# EAGLE design 12S (EAGLE 9.2.0)

## Sheet 1 of 2
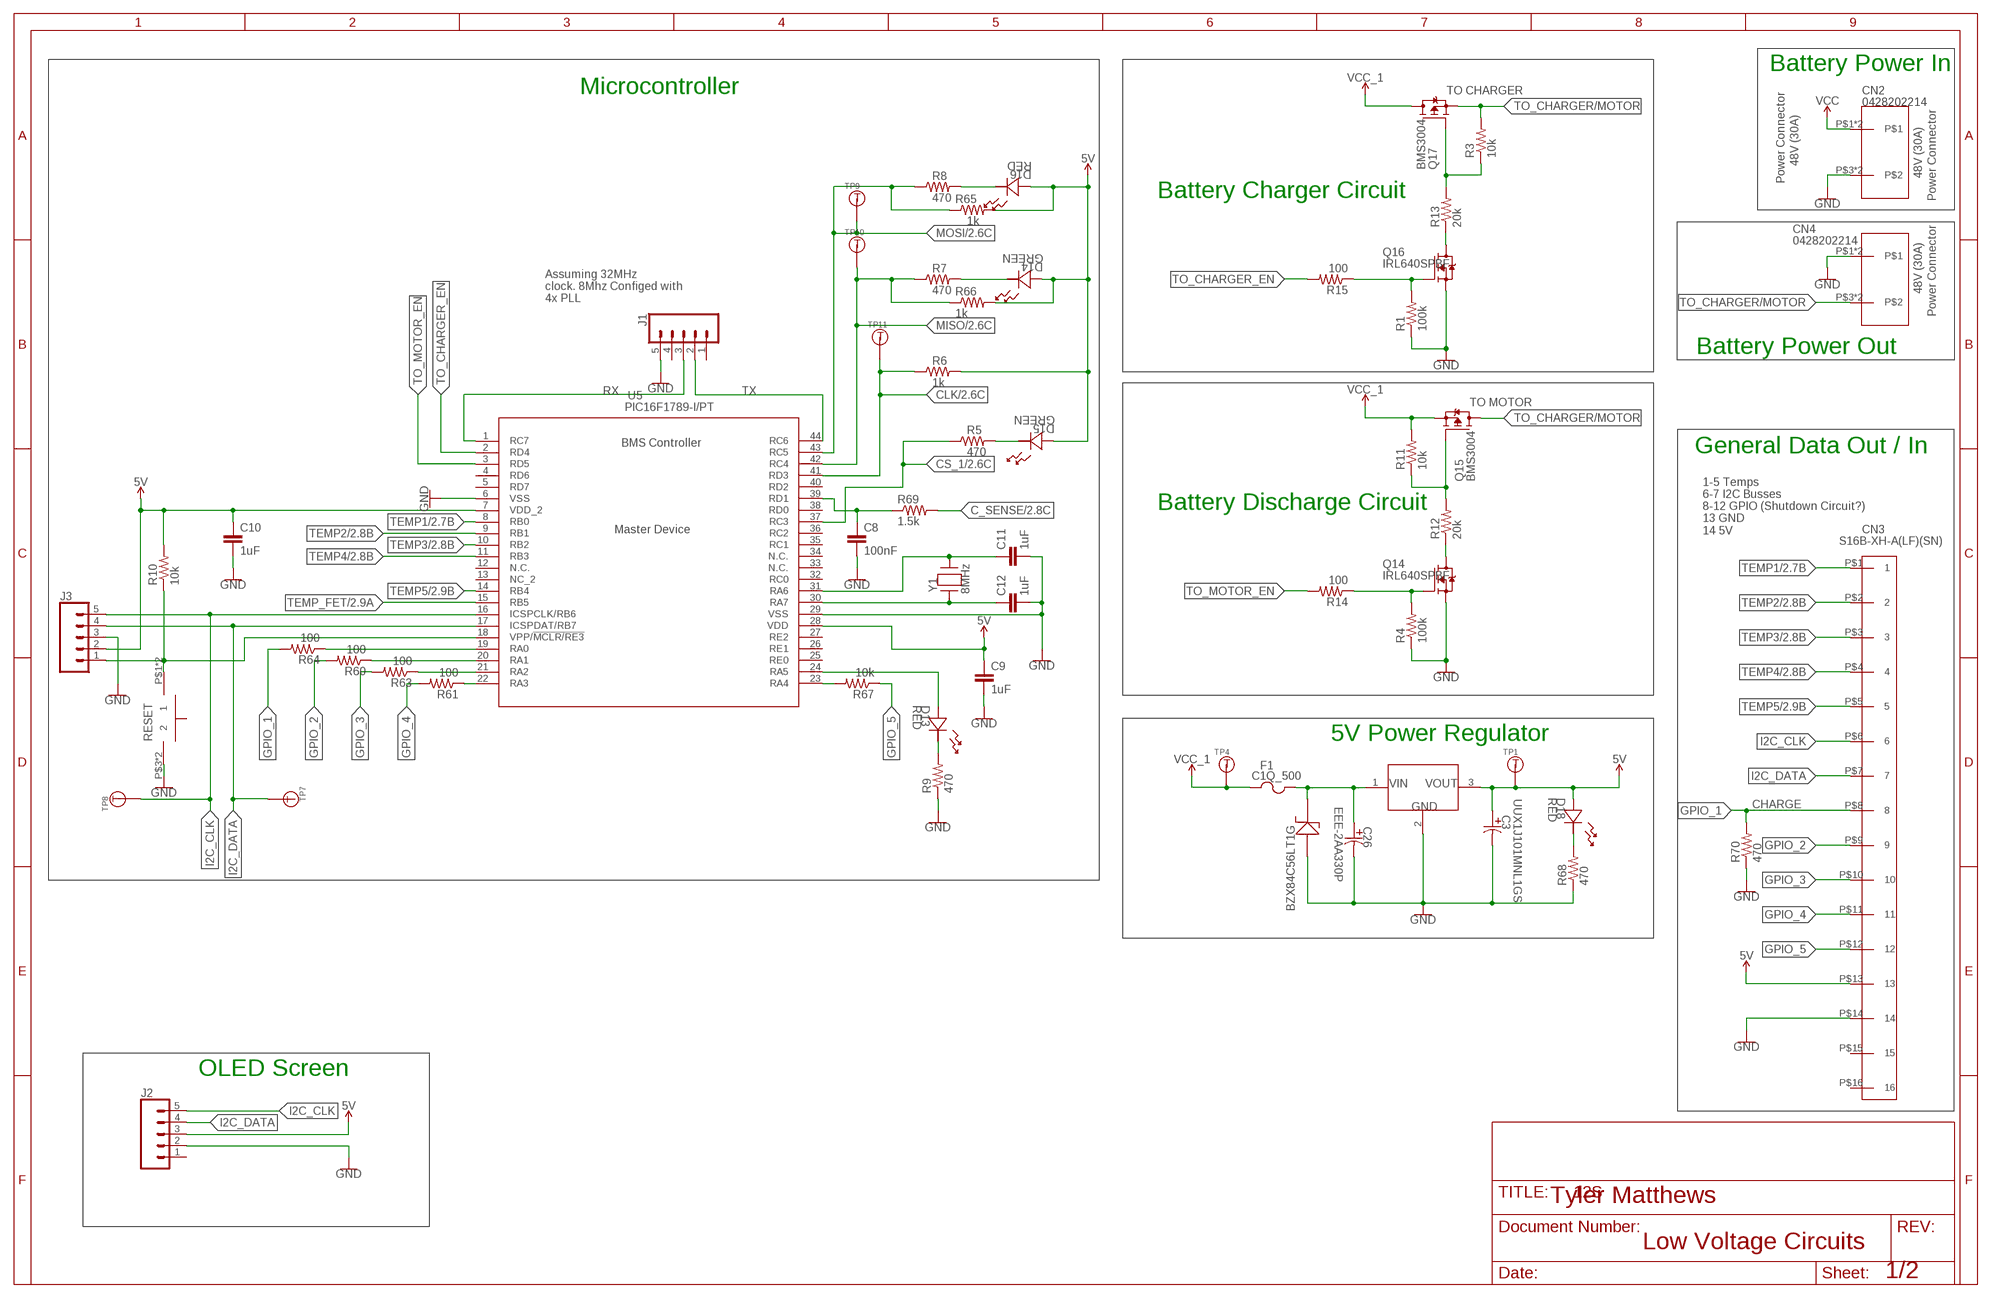
[diagram p0: schematic, sheet 1]

### Parts
C3  UUX1J101MNL1GS  [PCAP_10X10-ELECT]
C8  100nF  C-EUC0603  [C0603]
C9  1uF  C-EUC0603  [C0603]
C10  1uF  C-EUC0603  [C0603]
C11  1uF  C-EUC0603  [C0603]
C12  1uF  C-EUC0603  [C0603]
C26  EEE-2AA330P  [CAP_EEE_G]
CN2  0428202214  [0428202214]
CN3  S16B-XH-A(LF)(SN)  [S16B-XH-A(LF)(SN)]
CN4  0428202214  [0428202214]
D13  RED  LED0603  [LED_DIALIGHT_598]
D14  GREEN  LED0603  [LED_DIALIGHT_598]
D15  GREEN  LED0603  [LED_DIALIGHT_598]
D16  RED  LED0603  [LED_DIALIGHT_598]
D17  BZX84C56LT1G  [SOT-23]
D18  RED  LED0603  [LED_DIALIGHT_598]
F1  C1Q_500  [C1]
J1  CONN_05  [1X05]
J2  CONN_05  [1X05]
J3  CONN_05  [1X05]
Q14  IRL640SPBF  [D2PAK]
Q15  BMS3004  [TO-220]
Q16  IRL640SPBF  [D2PAK]
Q17  BMS3004  [TO-220]
R1  100k  R-US_R0603  [R0603]
R3  10k  R-US_R0603  [R0603]
R4  100k  R-US_R0603  [R0603]
R5  470  R-US_R0603  [R0603]
R6  1k  R-US_R0603  [R0603]
R7  470  R-US_R0603  [R0603]
R8  470  R-US_R0603  [R0603]
R9  470  R-US_R0603  [R0603]
R10  10k  R-US_R0603  [R0603]
R11  10k  R-US_R0603  [R0603]
R12  20k  R-US_R0603  [R0603]
R13  20k  R-US_R0603  [R0603]
R14  100  R-US_R0603  [R0603]
R15  100  R-US_R0603  [R0603]
R60  100  R-US_R0603  [R0603]
R61  100  R-US_R0603  [R0603]
R63  100  R-US_R0603  [R0603]
R64  100  R-US_R0603  [R0603]
R65  1k  R-US_R0603  [R0603]
R66  1k  R-US_R0603  [R0603]
R67  10k  R-US_R0603  [R0603]
R68  470  R-US_R0603  [R0603]
R69  1.5k  R-US_R0603  [R0603]
R70  470  R-US_R0603  [R0603]
S2  TL3305AF260QG  [TL3305AF260QG]
TP1  TP5015  [TP5015]
TP4  TP5015  [TP5015]
TP7  TP5015  [TP5015]
TP8  TP5015  [TP5015]
TP9  TP5015  [TP5015]
TP10  TP5015  [TP5015]
TP11  TP5015  [TP5015]
U3  SRH05S05  [SIP3]
U5  PIC16F1789-I/PT  [TQFP44_MC]
Y1  8MHz  FOXSDLF/080-20  [CRYSTAL_HC49SDLF]

### Nets
5V: C3.1 C9.1 C10.1 CN3.P$13 D14.2 D15.2 D16.2 D18.2 J2.3 J3.2 R6.2 R10.2 R65.2 R66.2 TP1.P$1 U3.3(VOUT) U5.7(VDD_2) U5.28(VDD) ; also sheet 2
C_SENSE: R69.2 ; also sheet 2
CLK: R6.1 TP11.P$1 U5.41(RD3) ; also sheet 2
CS_1: R5.1 U5.37(RC3) ; also sheet 2
GND: C3.2 C8.2 C9.2 C10.2 C11.2 C12.2 C26.2 CN2.P$3 CN2.P$4 CN3.P$14 CN4.P$1 CN4.P$2 D17.1 J1.5 J2.2 J3.3 Q14.2(S) Q16.2(S) R1.1 R4.1 R9.1 R68.1 R70.1 S2.P$3 S2.P$4 U3.2(GND) U5.6(VSS) U5.29(VSS) ; also sheet 2
GPIO_1: CN3.P$8 R64.2 R70.2
GPIO_2: CN3.P$9 R60.2
GPIO_3: CN3.P$10 R63.2
GPIO_4: CN3.P$11 R61.2
GPIO_5: CN3.P$12 R67.1
I2C_CLK: CN3.P$6 J2.5 J3.5 TP8.P$1 U5.16(ICSPCLK/RB6)
I2C_DATA: CN3.P$7 J2.4 J3.4 TP7.P$1 U5.17(ICSPDAT/RB7)
MISO: R7.1 R66.1 TP10.P$1 U5.42(RC4) ; also sheet 2
MOSI: R8.1 R65.1 TP9.P$1 U5.43(RC5) ; also sheet 2
N$1: D16.1 R8.2
N$2: D14.1 R7.2
N$3: D15.1 R5.2
N$4: Q17.1(G) R3.1 R13.2
N$5: R61.1 U5.22(RA3)
N$6: R63.1 U5.21(RA2)
N$7: R60.1 U5.20(RA1)
N$8: R64.1 U5.19(RA0)
N$9: D18.1 R68.2
N$10: R67.2 U5.23(RA4)
N$11: C8.1 R69.1 U5.39(RD1)
N$37: C26.1 D17.3 F1.2 U3.1(VIN)
N$39: Q14.3(D) R12.1
N$41: C11.1 U5.31(RA6) Y1.2
N$43: C12.1 U5.30(RA7) Y1.1
N$44: Q15.1(G) R11.1 R12.2
N$46: Q14.1(G) R4.2 R14.1
N$47: Q16.3(D) R13.1
N$48: Q16.1(G) R1.2 R15.1
N$49: J3.1 R10.1 S2.P$1 S2.P$2 U5.18(VPP/!MCLR/RE3)
N$50: D13.2 U5.24(RA5)
N$51: D13.1 R9.2
RX: J1.3 U5.1(RC7)
TEMP1: CN3.P$1 U5.8(RB0) ; also sheet 2
TEMP2: CN3.P$2 U5.9(RB1) ; also sheet 2
TEMP3: CN3.P$3 U5.10(RB2) ; also sheet 2
TEMP4: CN3.P$4 U5.11(RB3) ; also sheet 2
TEMP5: CN3.P$5 U5.14(RB4) ; also sheet 2
TEMP_FET: U5.15(RB5) ; also sheet 2
TO_CHARGER/MOTOR: CN4.P$3 CN4.P$4 Q15.2(D) Q17.3(S) R3.2
TO_CHARGER_EN: R15.2 U5.2(RD4)
TO_MOTOR_EN: R14.2 U5.3(RD5)
TX: J1.2 U5.44(RC6)
VCC: CN2.P$1 CN2.P$2 ; also sheet 2
VCC_1: F1.1 Q15.3(S) Q17.2(D) R11.2 TP4.P$1 ; also sheet 2
Unconnected: CN3.P$15 CN3.P$16 J1.1 J1.4 J2.1 U5.4(RD6) U5.5(RD7) U5.12(N.C.) U5.13(NC_2) U5.25(RE0) U5.26(RE1) U5.27(RE2) U5.32(RC0) U5.33(N.C.) U5.34(N.C.) U5.35(RC1) U5.36(RC2) U5.38(RD0) U5.40(RD2)

### Notes on the sheet
- Battery Power In
- Microcontroller | TO CHARGER
- Power Connector
- 48V (30A)
- 48V (30A)
- Power Connector
- Battery Charger Circuit
- Power Connector
- 48V (30A)
- Assuming 32MHz
  clock. 8Mhz Configed with 
  4x PLL
- Battery Power Out
- TO MOTOR
- General Data Out / In
- BMS Controller
- Battery Discharge Circuit
- Master Device
- 1-5 Temps
  6-7 I2C Busses
  8-12 GPIO (Shutdown Circuit?)
  13 GND
  14 5V
- RESET | 5V Power Regulator
- CHARGE
- BZX84C56LT1G
- OLED Screen
- Tyler Matthews
- Low Voltage Circuits

## Sheet 2 of 2
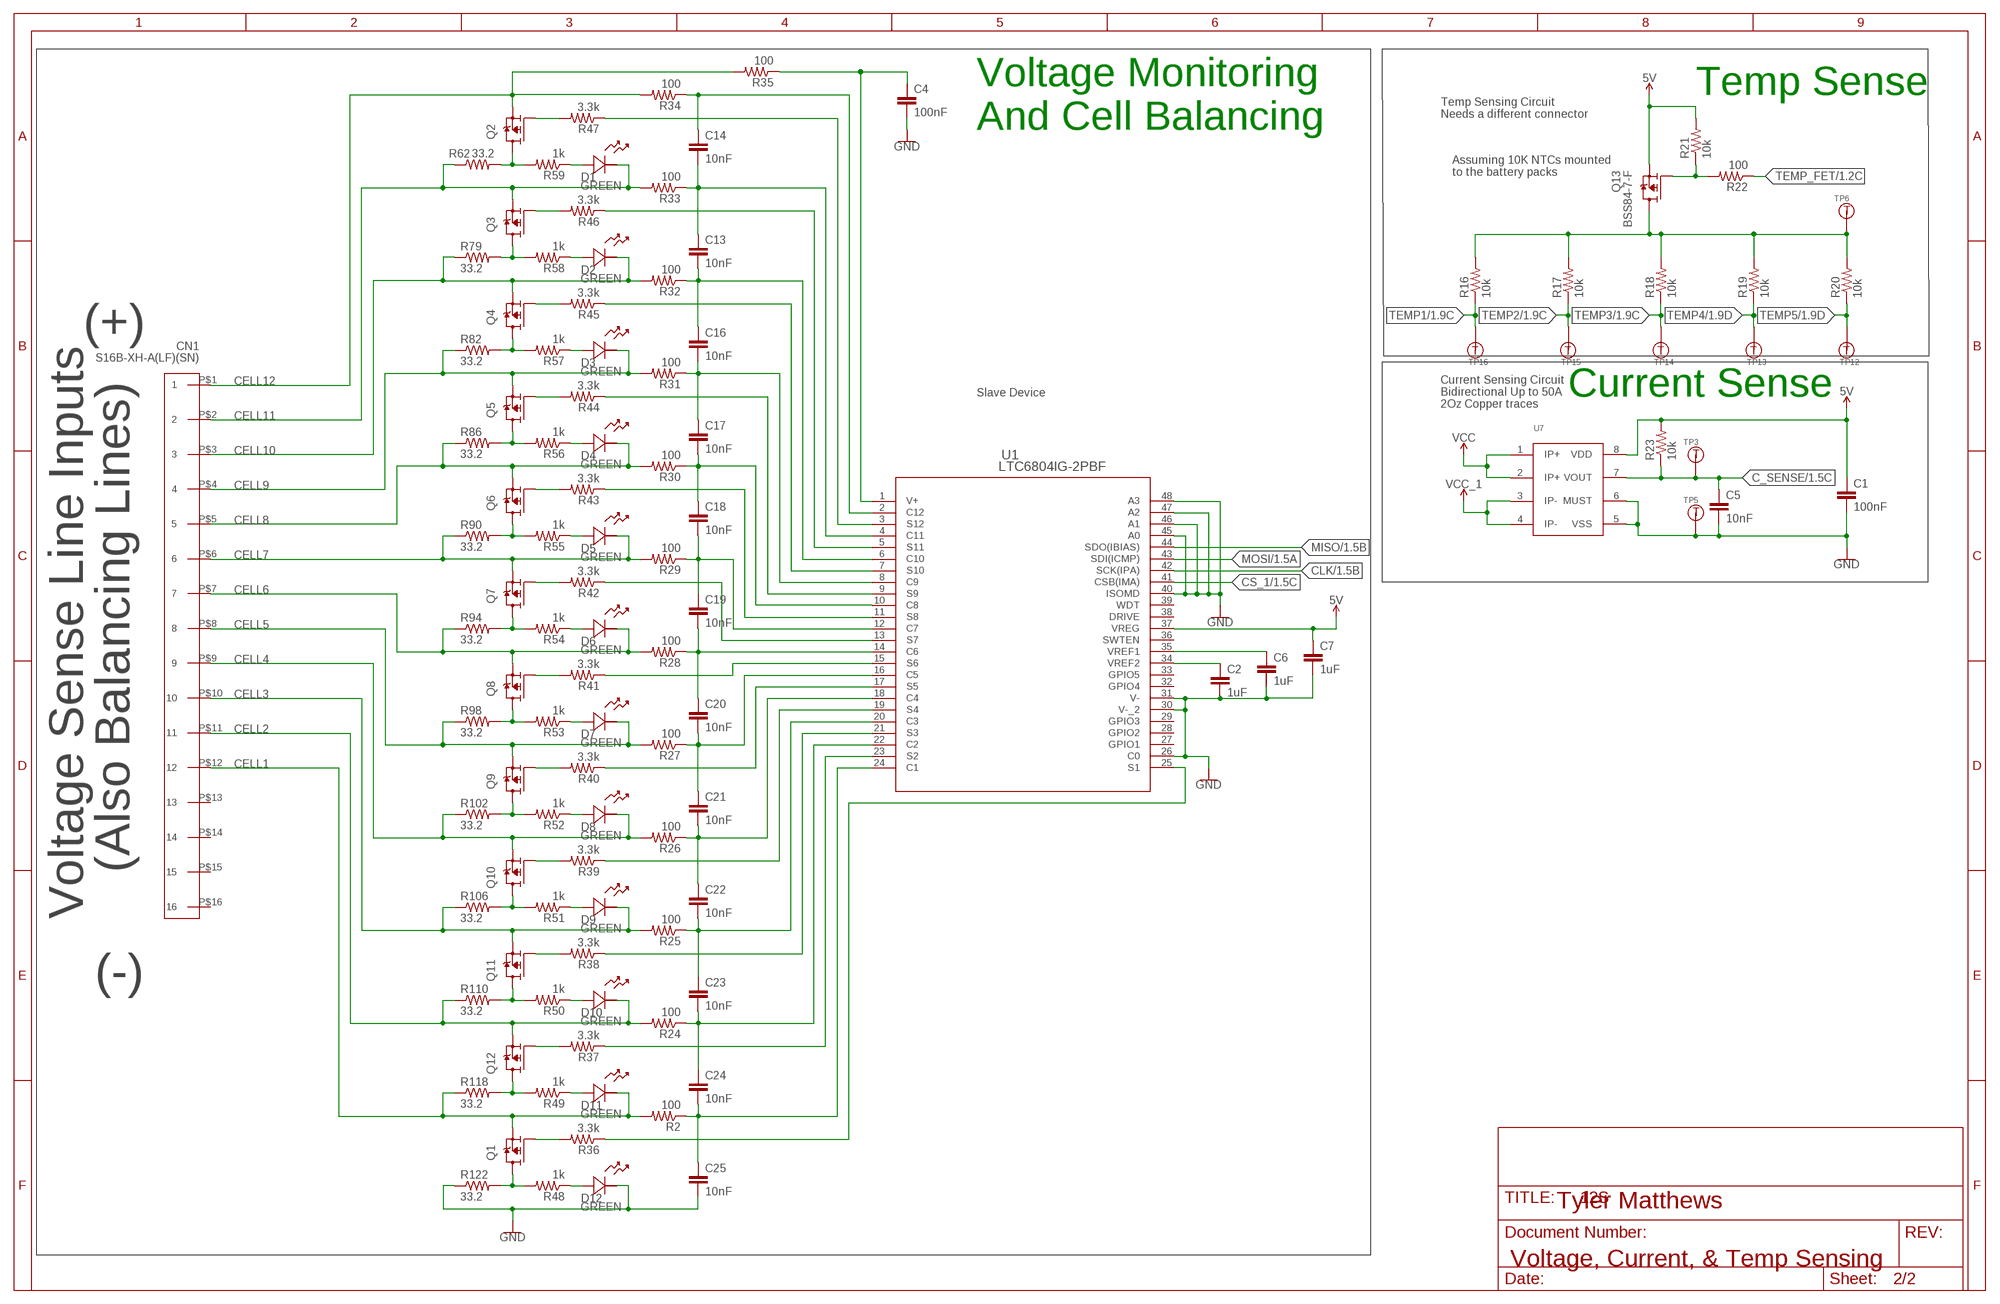
[diagram p1: schematic, sheet 2]

### Parts
C1  100nF  C-EUC0603  [C0603]
C2  1uF  C-EUC0603  [C0603]
C4  100nF  C-EUC0603  [C0603]
C5  10nF  C-EUC0603  [C0603]
C6  1uF  C-EUC0603  [C0603]
C7  1uF  C-EUC0603  [C0603]
C13  10nF  C-EUC0603  [C0603]
C14  10nF  C-EUC0603  [C0603]
C16  10nF  C-EUC0603  [C0603]
C17  10nF  C-EUC0603  [C0603]
C18  10nF  C-EUC0603  [C0603]
C19  10nF  C-EUC0603  [C0603]
C20  10nF  C-EUC0603  [C0603]
C21  10nF  C-EUC0603  [C0603]
C22  10nF  C-EUC0603  [C0603]
C23  10nF  C-EUC0603  [C0603]
C24  10nF  C-EUC0603  [C0603]
C25  10nF  C-EUC0603  [C0603]
CN1  S16B-XH-A(LF)(SN)  [S16B-XH-A(LF)(SN)]
D1  GREEN  LED0603  [LED_DIALIGHT_598]
D2  GREEN  LED0603  [LED_DIALIGHT_598]
D3  GREEN  LED0603  [LED_DIALIGHT_598]
D4  GREEN  LED0603  [LED_DIALIGHT_598]
D5  GREEN  LED0603  [LED_DIALIGHT_598]
D6  GREEN  LED0603  [LED_DIALIGHT_598]
D7  GREEN  LED0603  [LED_DIALIGHT_598]
D8  GREEN  LED0603  [LED_DIALIGHT_598]
D9  GREEN  LED0603  [LED_DIALIGHT_598]
D10  GREEN  LED0603  [LED_DIALIGHT_598]
D11  GREEN  LED0603  [LED_DIALIGHT_598]
D12  GREEN  LED0603  [LED_DIALIGHT_598]
Q1  BSS308PEH6327XTSA1  [BSS308PEH6327XTSA1]
Q2  BSS308PEH6327XTSA1  [BSS308PEH6327XTSA1]
Q3  BSS308PEH6327XTSA1  [BSS308PEH6327XTSA1]
Q4  BSS308PEH6327XTSA1  [BSS308PEH6327XTSA1]
Q5  BSS308PEH6327XTSA1  [BSS308PEH6327XTSA1]
Q6  BSS308PEH6327XTSA1  [BSS308PEH6327XTSA1]
Q7  BSS308PEH6327XTSA1  [BSS308PEH6327XTSA1]
Q8  BSS308PEH6327XTSA1  [BSS308PEH6327XTSA1]
Q9  BSS308PEH6327XTSA1  [BSS308PEH6327XTSA1]
Q10  BSS308PEH6327XTSA1  [BSS308PEH6327XTSA1]
Q11  BSS308PEH6327XTSA1  [BSS308PEH6327XTSA1]
Q12  BSS308PEH6327XTSA1  [BSS308PEH6327XTSA1]
Q13  BSS84-7-F  [SOT-23]
R2  100  R-US_R0603  [R0603]
R16  10k  R-US_R0603  [R0603]
R17  10k  R-US_R0603  [R0603]
R18  10k  R-US_R0603  [R0603]
R19  10k  R-US_R0603  [R0603]
R20  10k  R-US_R0603  [R0603]
R21  10k  R-US_R0603  [R0603]
R22  100  R-US_R0603  [R0603]
R23  10k  R-US_R0603  [R0603]
R24  100  R-US_R0603  [R0603]
R25  100  R-US_R0603  [R0603]
R26  100  R-US_R0603  [R0603]
R27  100  R-US_R0603  [R0603]
R28  100  R-US_R0603  [R0603]
R29  100  R-US_R0603  [R0603]
R30  100  R-US_R0603  [R0603]
R31  100  R-US_R0603  [R0603]
R32  100  R-US_R0603  [R0603]
R33  100  R-US_R0603  [R0603]
R34  100  R-US_R0603  [R0603]
R35  100  R-US_R0603  [R0603]
R36  3.3k  R-US_R0603  [R0603]
R37  3.3k  R-US_R0603  [R0603]
R38  3.3k  R-US_R0603  [R0603]
R39  3.3k  R-US_R0603  [R0603]
R40  3.3k  R-US_R0603  [R0603]
R41  3.3k  R-US_R0603  [R0603]
R42  3.3k  R-US_R0603  [R0603]
R43  3.3k  R-US_R0603  [R0603]
R44  3.3k  R-US_R0603  [R0603]
R45  3.3k  R-US_R0603  [R0603]
R46  3.3k  R-US_R0603  [R0603]
R47  3.3k  R-US_R0603  [R0603]
R48  1k  R-US_R0603  [R0603]
R49  1k  R-US_R0603  [R0603]
R50  1k  R-US_R0603  [R0603]
R51  1k  R-US_R0603  [R0603]
R52  1k  R-US_R0603  [R0603]
R53  1k  R-US_R0603  [R0603]
R54  1k  R-US_R0603  [R0603]
R55  1k  R-US_R0603  [R0603]
R56  1k  R-US_R0603  [R0603]
R57  1k  R-US_R0603  [R0603]
R58  1k  R-US_R0603  [R0603]
R59  1k  R-US_R0603  [R0603]
R62  33.2  R-US_R0805  [R0805]
R79  33.2  R-US_R0805  [R0805]
R82  33.2  R-US_R0805  [R0805]
R86  33.2  R-US_R0805  [R0805]
R90  33.2  R-US_R0805  [R0805]
R94  33.2  R-US_R0805  [R0805]
R98  33.2  R-US_R0805  [R0805]
R102  33.2  R-US_R0805  [R0805]
R106  33.2  R-US_R0805  [R0805]
R110  33.2  R-US_R0805  [R0805]
R118  33.2  R-US_R0805  [R0805]
R122  33.2  R-US_R0805  [R0805]
TP3  TP5015  [TP5015]
TP5  TP5015  [TP5015]
TP6  TP5015  [TP5015]
TP12  TP5015  [TP5015]
TP13  TP5015  [TP5015]
TP14  TP5015  [TP5015]
TP15  TP5015  [TP5015]
TP16  TP5015  [TP5015]
U1  LTC6804IG-2PBF  [SSOP-48_G]
U7  MLX91210  [SOIC-8]

### Nets
5V: C1.1 C7.1 Q13.2(S) R21.2 R23.2 U1.37(VREG) U7.8(VDD) ; also sheet 1
C_SENSE: C5.1 R23.1 TP3.P$1 U7.7(VOUT) ; also sheet 1
CELL1: CN1.P$12 D11.1 Q1.P$S(S) R2.2 R118.1
CELL2: CN1.P$11 D10.1 Q12.P$S(S) R24.2 R110.1
CELL3: CN1.P$10 D9.1 Q11.P$S(S) R25.2 R106.1
CELL4: CN1.P$9 D8.1 Q10.P$S(S) R26.2 R102.1
CELL5: CN1.P$8 D7.1 Q9.P$S(S) R27.2 R98.1
CELL6: CN1.P$7 D6.1 Q8.P$S(S) R28.2 R94.1
CELL7: CN1.P$6 D5.1 Q7.P$S(S) R29.2 R90.1
CELL8: CN1.P$5 D4.1 Q6.P$S(S) R30.2 R86.1
CELL9: CN1.P$4 D3.1 Q5.P$S(S) R31.2 R82.1
CELL10: CN1.P$3 D2.1 Q4.P$S(S) R32.2 R79.1
CELL11: CN1.P$2 D1.1 Q3.P$S(S) R33.2 R62.1
CELL12: CN1.P$1 Q2.P$S(S) R34.2 R35.2
CLK: U1.42(SCK(IPA)) ; also sheet 1
CS_1: U1.41(CSB(IMA)) ; also sheet 1
GND: C1.2 C2.2 C4.2 C5.2 C6.2 C7.2 C25.2 D12.1 R122.1 TP5.P$1 U1.26(C0) U1.30(V-_2) U1.31(V-) U1.40(ISOMD) U1.45(A0) U1.46(A1) U1.47(A2) U1.48(A3) U7.5(VSS) U7.6(MUST) ; also sheet 1
MISO: U1.44(SDO(IBIAS)) ; also sheet 1
MOSI: U1.43(SDI(ICMP)) ; also sheet 1
N$38: C6.1 U1.35(VREF1)
N$40: C2.1 U1.34(VREF2)
N$42: Q13.1(G) R21.1 R22.2
N$52: Q13.3(D) R16.2 R17.2 R18.2 R19.2 R20.2 TP6.P$1
N$56: Q2.P$G(G) R47.2
N$57: R47.1 U1.3(S12)
N$58: C14.1 R34.1 U1.2(C12)
N$59: Q2.P$D(D) R59.2 R62.2
N$60: D1.2 R59.1
N$61: C13.1 C14.2 R33.1 U1.4(C11)
N$62: R46.1 U1.5(S11)
N$63: Q3.P$G(G) R46.2
N$64: Q3.P$D(D) R58.2 R79.2
N$65: D2.2 R58.1
N$66: C13.2 C16.1 R32.1 U1.6(C10)
N$67: Q4.P$G(G) R45.2
N$68: R45.1 U1.7(S10)
N$69: Q4.P$D(D) R57.2 R82.2
N$70: D3.2 R57.1
N$71: Q5.P$G(G) R44.2
N$72: C16.2 C17.1 R31.1 U1.8(C9)
N$73: R44.1 U1.9(S9)
N$74: Q5.P$D(D) R56.2 R86.2
N$75: D4.2 R56.1
N$76: C17.2 C18.1 R30.1 U1.10(C8)
N$77: Q6.P$G(G) R43.2
N$78: R43.1 U1.11(S8)
N$79: Q6.P$D(D) R55.2 R90.2
N$80: D5.2 R55.1
N$81: C18.2 C19.1 R29.1 U1.12(C7)
N$82: Q7.P$G(G) R42.2
N$83: Q7.P$D(D) R54.2 R94.2
N$84: D6.2 R54.1
N$85: Q8.P$G(G) R41.2
N$86: Q8.P$D(D) R53.2 R98.2
N$87: D7.2 R53.1
N$88: Q9.P$G(G) R40.2
N$89: Q9.P$D(D) R52.2 R102.2
N$90: D8.2 R52.1
N$91: Q10.P$G(G) R39.2
N$92: Q10.P$D(D) R51.2 R106.2
N$93: D9.2 R51.1
N$94: Q11.P$G(G) R38.2
N$95: Q11.P$D(D) R50.2 R110.2
N$96: D10.2 R50.1
N$97: C23.2 C24.1 R24.1 U1.22(C2)
N$98: R38.1 U1.21(S3)
N$99: C22.2 C23.1 R25.1 U1.20(C3)
N$100: R39.1 U1.19(S4)
N$101: C21.2 C22.1 R26.1 U1.18(C4)
N$102: R40.1 U1.17(S5)
N$103: C20.2 C21.1 R27.1 U1.16(C5)
N$104: R41.1 U1.15(S6)
N$105: C19.2 C20.1 R28.1 U1.14(C6)
N$106: R42.1 U1.13(S7)
N$110: Q12.P$G(G) R37.2
N$111: Q12.P$D(D) R49.2 R118.2
N$112: D11.2 R49.1
N$113: R37.1 U1.23(S2)
N$114: C24.2 C25.1 R2.1 U1.24(C1)
N$115: Q1.P$G(G) R36.2
N$116: Q1.P$D(D) R48.2 R122.2
N$117: D12.2 R48.1
N$118: R36.1 U1.25(S1)
TEMP1: R16.1 TP16.P$1 ; also sheet 1
TEMP2: R17.1 TP15.P$1 ; also sheet 1
TEMP3: R18.1 TP14.P$1 ; also sheet 1
TEMP4: R19.1 TP13.P$1 ; also sheet 1
TEMP5: R20.1 TP12.P$1 ; also sheet 1
TEMP_FET: R22.1 ; also sheet 1
V+: C4.1 R35.1 U1.1(V+)
VCC: U7.1(IP+) U7.2(IP+) ; also sheet 1
VCC_1: U7.3(IP-) U7.4(IP-) ; also sheet 1
Unconnected: CN1.P$13 CN1.P$14 CN1.P$15 CN1.P$16 U1.27(GPIO1) U1.28(GPIO2) U1.29(GPIO3) U1.32(GPIO4) U1.33(GPIO5) U1.36(SWTEN) U1.38(DRIVE) U1.39(WDT)

### Notes on the sheet
- Temp Sense
- Temp Sensing Circuit
  Needs a different connector
- Voltage Monitoring 
  And Cell Balancing
- Assuming 10K NTCs mounted
  to the battery packs
- (+)
- Slave Device | Current Sense
- Current Sensing Circuit
  Bidirectional Up to 50A
  2Oz Copper traces
- (Also Balancing Lines)
- Voltage Sense Line Inputs
- (-)
- Tyler Matthews
- Voltage, Current, & Temp Sensing

## Library data of the parts
C1 C2 C4-C14 C16-C25 = resistor:C-EU: CAPACITOR, European symbol
C3 = SDP:UUX1J101MNL1GS; DIGIKEY_LINK: https://www.digikey.com/product-detail/en/nichicon/UUX1J101MNL1GS/493-7453-1-ND/3768847; MANUFACTURER_PART_NUMBER: UUX1J101MNL1GS; PRICE: 0.62000; VENDOR: Nichicon
C26 = SDP:EEE-2AA330P; MANUFACTURER_PART_NUMBER: EEE2AA330P; VENDOR: Panasonic
CN1 CN3 = SDP:S16B-XH-A(LF)(SN); DIGIKEY_LINK: https://www.digikey.com/product-detail/en/jst-sales-america-inc/S16B-XH-A-LF-SN/455-2229-ND/1651027; MANUFACTURER_PART_NUMBER: S16B-XH-A(LF)(SN); PRICE: 0.93000; VENDOR: JST
CN2 CN4 = SDP:0428202214; DIGIKEY_LINK: https://www.digikey.com/product-detail/en/molex-llc/0428202214/WM11911-ND/5405474; MANUFACTURER_PART_NUMBER: 0428202214; PRICE: 4.68000; VENDOR: Molex
D1-D16 D18 = SDP:LED0603; DIGIKEY_LINK: https://www.digikey.com/product-detail/en/dialight/5988070107F/350-2035-1-ND/1291339; MANUFACTURER_PART_NUMBER: 5988070107F; PRICE: 0.47000; VENDOR: Dialight
D17 = SDP:BZX84C56LT1G; DIGIKEY_LINK: https://www.digikey.com/product-detail/en/on-semiconductor/BZX84C56LT1G/BZX84C56LT1GOSCT-ND/3462251; MANUFACTURER_PART_NUMBER: BZX84C56LT1G; PRICE: 0.15000; VENDOR: Diodes Inc
F1 = SDP:C1Q_500; DIGIKEY_LINK: https://www.digikey.com/product-detail/en/bel-fuse-inc/C1Q-500/507-1075-1-ND/615048; MANUFACTURER_PART_NUMBER: C1Q 500; PRICE: 0.35000; VENDOR: BelFuse
J1-J3 = SDP:CONN_05: Multi connection point. Often used as Generic Header-pin footprint for 0.1 inch spaced/style header connections On any of the 0.1 inch spaced packages, you can populate with these: Break Away Headers - Straight <https://www.sparkfun.com/products/116> (PRT-00116) Break Away Male Headers - Right Angle <https://www.sparkfun.com/products/553> (PRT-00553) Female Headers <https://www.sparkfun.com/products/115> (PRT-00115) Break Away Headers - Machine Pin <https://www.sparkfun.com/products/117> (PRT-00117) Break Away Female Headers - Swiss Machine Pin <https://www.sparkfun.com/products/743> (PRT-00743) For SCREWTERMINALS and SPRING TERMINALS visit here: Screw Terimnals on SparkFun.com <https://www.sparkfun.com/search/results?term=Screw+Terminals> (5mm/3.5mm/2.54mm spacing) This device is also useful as a general connection point to wire up your design to another part of your project. Our various solder wires solder well into these plated through hole pads. Hook-Up Wire - Assortment (Stranded, 22 AWG) <https://www.sparkfun.com/products/11375> (PRT-11375) Hook-Up Wire - Assortment (Solid Core, 22 AWG) <https://www.sparkfun.com/products/11367> (PRT-11367) View the entire wire category on our website here <https://www.sparkfun.com/categories/141> Special notes: Molex polarized connector foot print use with SKU : PRT-08231 with associated crimp pins and housings. 1MM SMD Version SKU: PRT-10208; DIGIKEY_LINK: https://www.digikey.com/product-detail/en/harwin-inc/M20-9990546/952-2268-ND/3728232; MANUFACTURER_PART_NUMBER: M20-9990546; PRICE: 0.20000; VENDOR: Harwin Inc.
Q1-Q12 = SDP:BSS308PEH6327XTSA1: BSS308PEH6327XTSA1 Datasheet <https://www.digikey.com/product-detail/en/infineon-technologies/BSS308PEH6327XTSA1/BSS308PEH6327XTSA1CT-ND/3196649>; DIGIKEY_LINK: https://www.digikey.com/product-detail/en/infineon-technologies/BSS308PEH6327XTSA1/BSS308PEH6327XTSA1CT-ND/3196649; MANUFACTURER_PART_NUMBER: BSS308PEH6327XTSA1; PRICE: 0.49000; VENDOR: Infineon Technologies
Q13 = SDP:BSS84-7-F; DIGIKEY_LINK: https://www.digikey.com/product-detail/en/diodes-incorporated/BSS84-7-F/BSS84-FDICT-ND/717844; MANUFACTURER_PART_NUMBER: BSS847F; PRICE: 0.27000; VENDOR: Diodes Inc
Q14 Q16 = SDP:IRL640SPBF; DIGIKEY_LINK: https://www.digikey.com/product-detail/en/vishay-siliconix/IRL640SPBF/IRL640SPBF-ND/812145; MANUFACTURER_PART_NUMBER: IRL640SPBF; PRICE: 2.08000; VENDOR: Vishay
Q15 Q17 = SDP:BMS3004: BMS 3004; DIGIKEY_LINK: https://www.digikey.com/product-detail/en/on-semiconductor/BMS3004-1E/BMS3004-1EOS-ND/4847553; MANUFACTURER_PART_NUMBER: BMS3004-1E; PRICE: 4.17000; VENDOR: ON Semiconductor
R1-R70 R79 R82 R86 R90 R94 R98 R102 R106 R110 R118 R122 = resistor:R-US_: RESISTOR, American symbol
S2 = SDP:TL3305AF260QG; DIGIKEY_LINK: https://www.digikey.com/product-detail/en/e-switch/TL3305AF260QG/EG5353TR-ND/5816184; MANUFACTURER_PART_NUMBER: TL3305AF260QG; PRICE: 0.20000; VENDOR: E-Switch
TP1 TP3-TP16 = SDP:TP5015; DIGIKEY_LINK: https://www.digikey.com/product-detail/en/keystone-electronics/5015/36-5015CT-ND/278886; MANUFACTURER_PART_NUMBER: 5015; PRICE: 0.44000; VENDOR: Keystone Electronics
U1 = SDP:LTC6804IG-2PBF; DIGIKEY_LINK: https://www.digikey.com/product-detail/en/linear-technology-analog-devices/LTC6804HG-2-PBF/LTC6804HG-2-PBF-ND/4155471; MANUFACTURER_PART_NUMBER: LTC6804HG-2#PBF; PRICE: 21.36000; VENDOR: Linear Technology
U3 = SDP:SRH05S05: SRH05S05 Relevant Datasheet <https://www.xppower.com/Portals/0/pdfs/SF_SRH05.pdf>; DIGIKEY_LINK: https://www.digikey.com/product-detail/en/xp-power/SRH05S05/1470-4531-ND/8021459; MANUFACTURER_PART_NUMBER: SRH05S05; PRICE: 8.00000; VENDOR: XP POWER
U5 = SDP:PIC16F1789-I/PT; DIGIKEY_LINK: https://www.digikey.com/product-detail/en/microchip-technology/PIC16F1789T-I-PT/PIC16F1789T-I-PTCT-ND/8637251; MANUFACTURER_PART_NUMBER: PIC16F1789T-I/PT; PRICE: 2.40000; VENDOR: Microchip
U7 = SDP:MLX91210: MLX91210 Current Sensor Relevant Information <https://www.digikey.com/product-detail/en/melexis-technologies-nv/MLX91210KDC-CAS-102-SP/MLX91210KDC-CAS-102-SP-ND/6173906>; DIGIKEY_LINK: https://www.digikey.com/product-detail/en/melexis-technologies-nv/MLX91210KDC-CAS-102-SP/MLX91210KDC-CAS-102-SP-ND/6173906; MANUFACTURER_PART_NUMBER: MLX91210KDC-CAS-102-SP; PRICE: 4.29000; VENDOR: Melexis Technologies NV
Y1 = SDP:FOXSDLF/080-20; DIGIKEY_LINK: https://www.digikey.com/product-detail/en/fox-electronics/FC4SDCBMF8.0-T1/631-1010-1-ND/1024715; MANUFACTURER_PART_NUMBER: FC4SDCBMF8.0-T1; PRICE: 0.34000; VENDOR: Fox

## Board
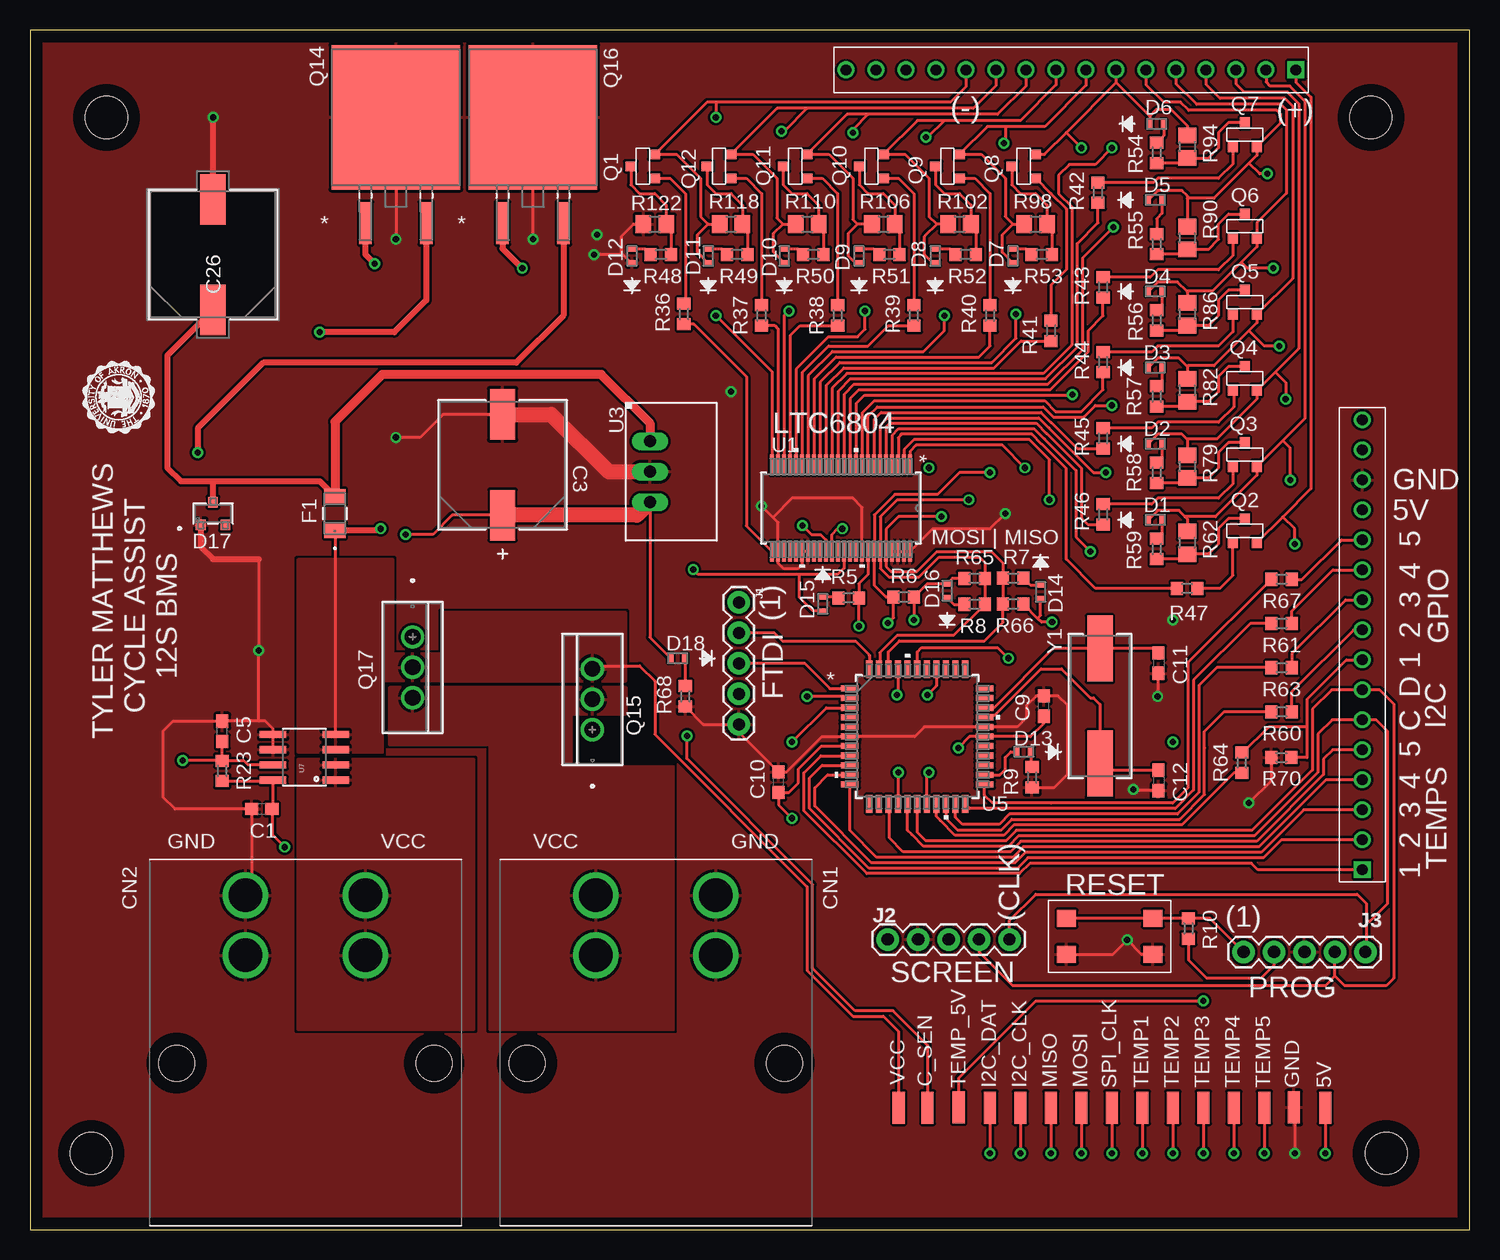
[diagram p2: board, top side]
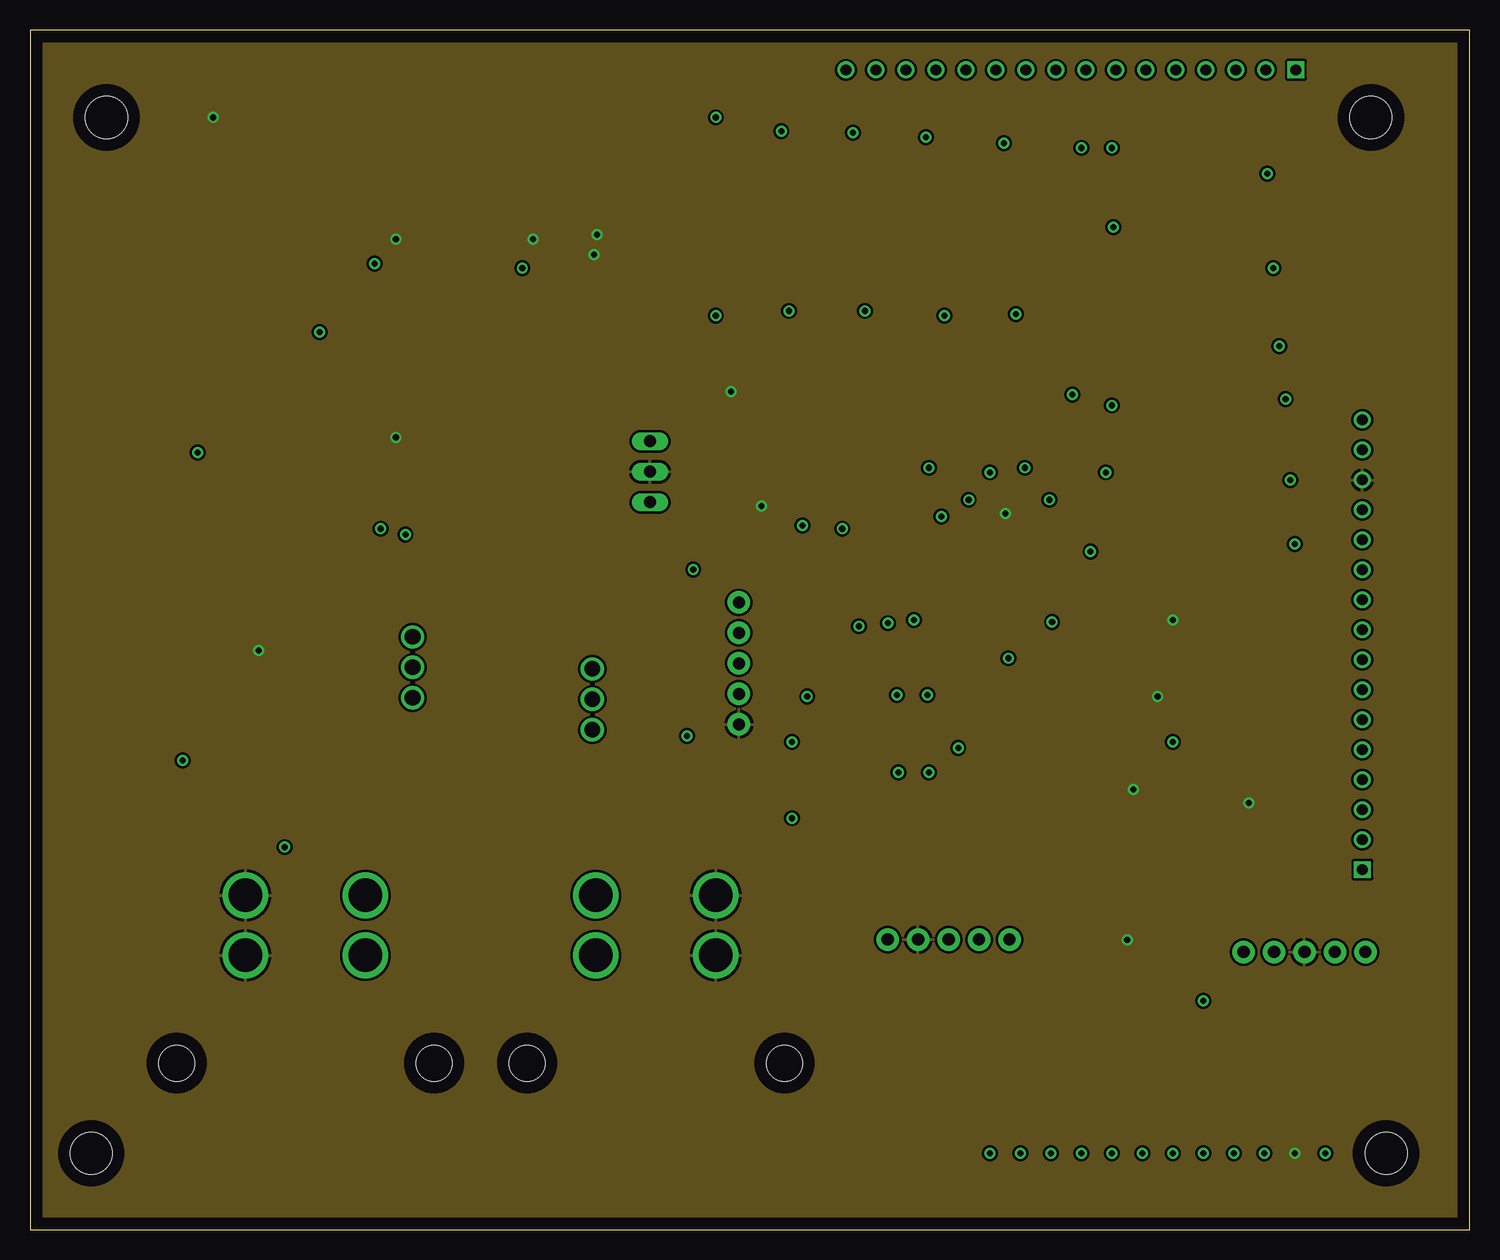
[diagram p3: board, inner layer Route2]
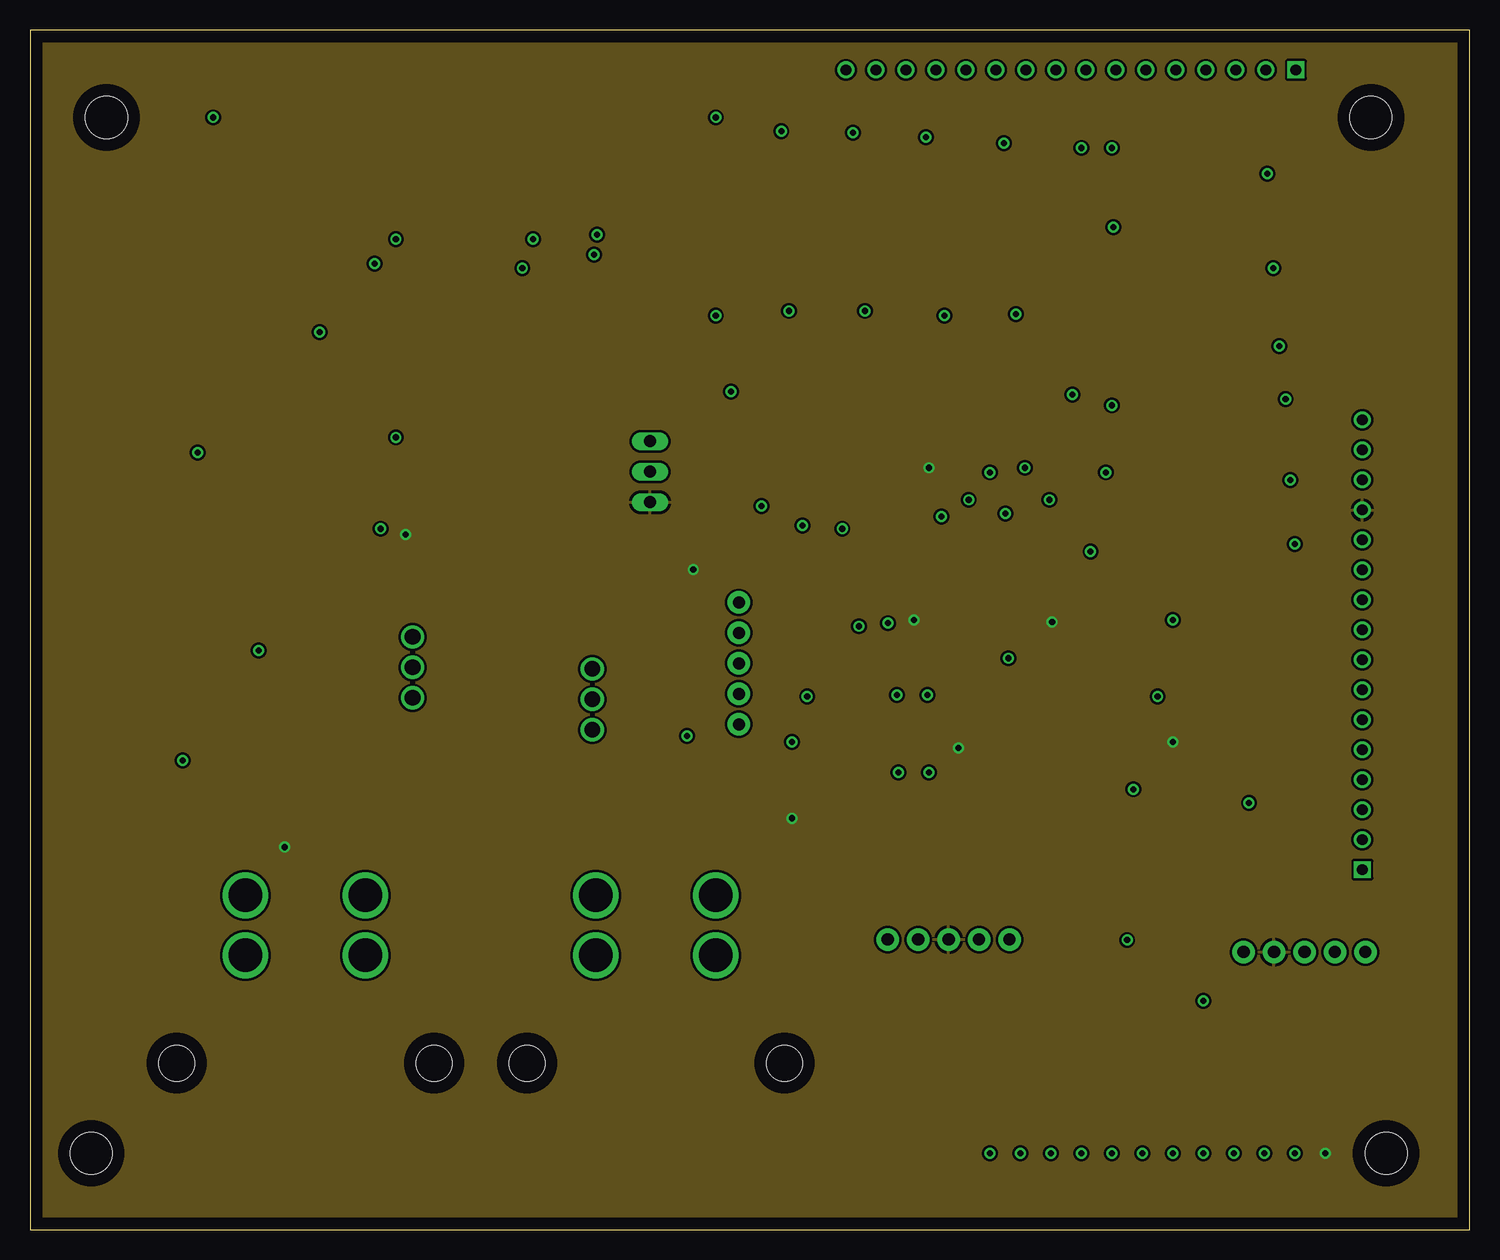
[diagram p4: board, inner layer Route15]
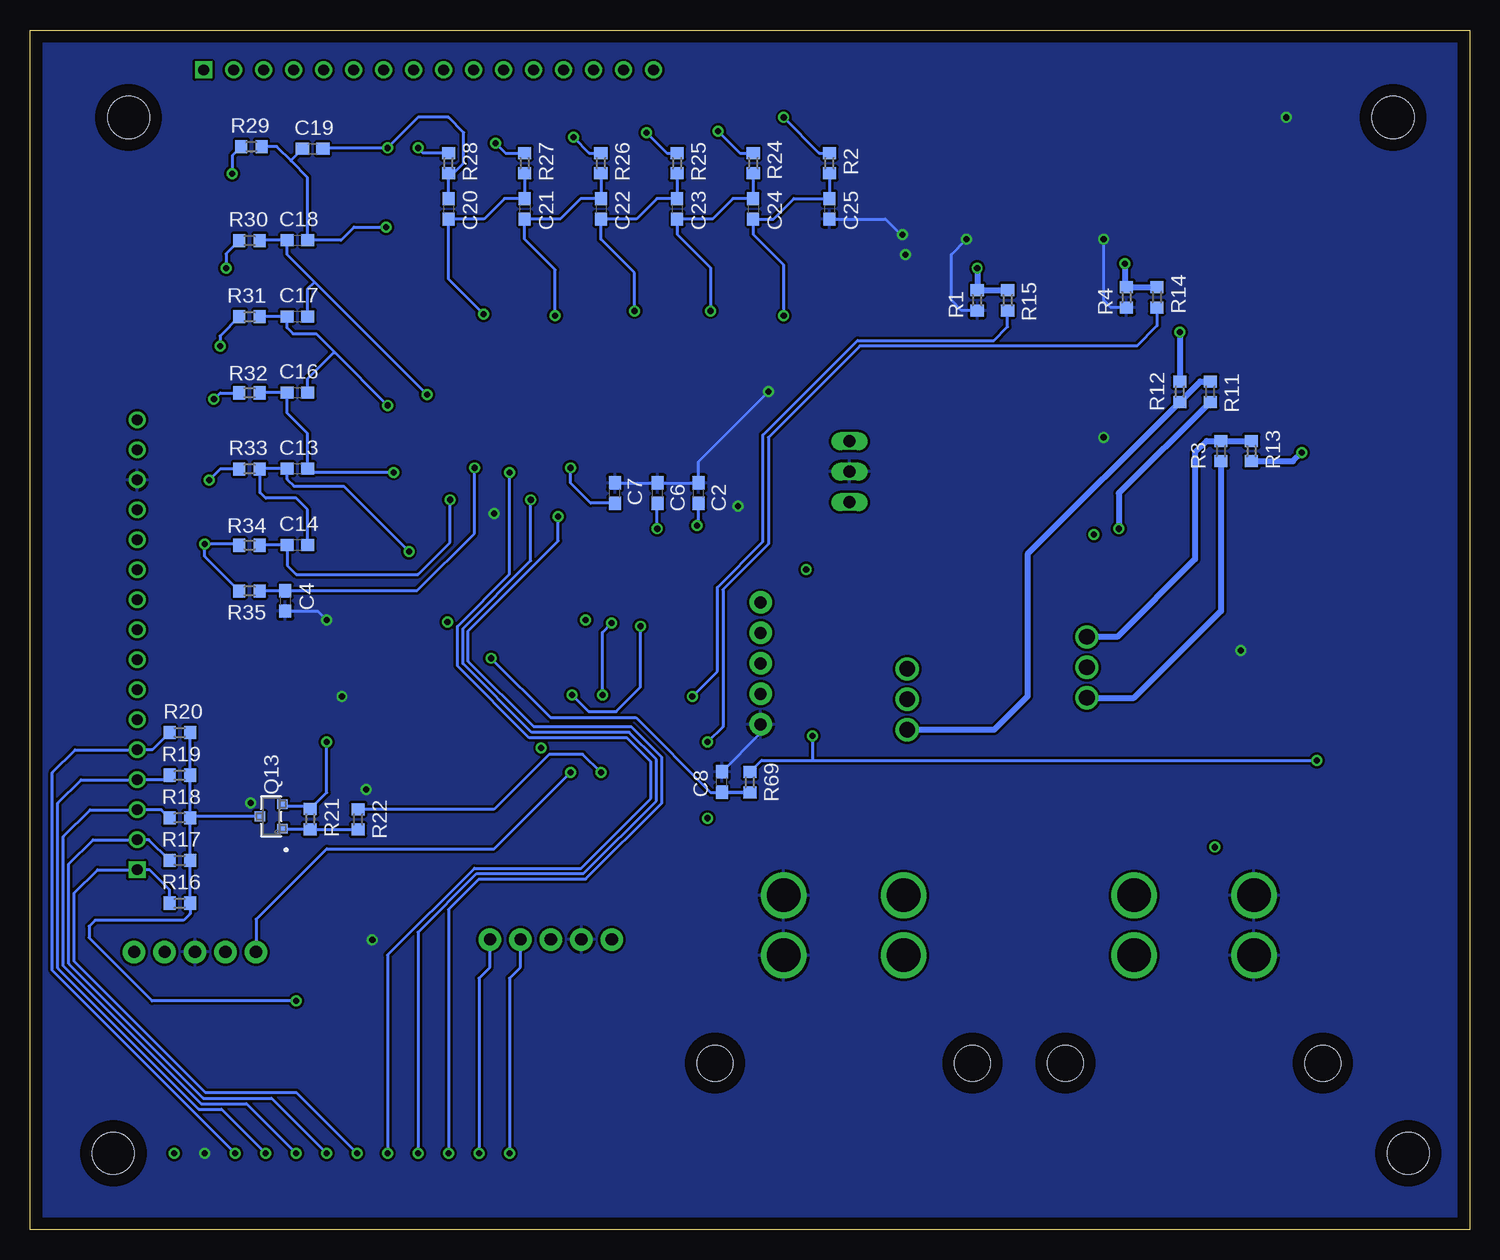
[diagram p5: board, bottom side, seen from below]

Size 120 x 100 mm. Coordinates in mm from the lower left corner, seen from the top.
Outline: 0,0 120,0 120,100 0,100 0,0
Copper layers (1*2*15*16): Top 0.035mm / dielectric 1.5mm / Route2 0.035mm / dielectric 0.15mm / Route15 0.035mm / dielectric 0.2mm / Bottom 0.035mm
Design rules "default *": minimum track width 10mil, minimum drill 20mil, track to track 8mil, track to pad 8mil, pad to pad 6mil, via to via 8mil, smd to smd 6mil, copper to edge 40mil, drill to drill 6mil, minimum pad ring 10mil, minimum via ring 8mil, stop-mask expansion 4mil, vias tented up to drill 0mil, thermal gap 10mil
Holes 3.5 mm at 111.78,92.71 113.05,6.35 5.1,6.35 6.37,92.71

### Footprints (pad centres in the part's own frame; a part is rotated, then mirrored left to right if it is on the bottom)
C0603 = smd 1.1 x 1: 1 -0.85,0; 2 0.85,0
PCAP_10X10-ELECT = smd 4.216 x 2.108: 1 -4.204,0; 2 4.204,0
CAP_EEE_G = smd 4.216 x 2.108: 1 -4.597,0; 2 4.597,0
S16B-XH-A(LF)(SN) = drill 0.9 square: P$1 0,0 | drill 0.9: P$2 2.5,0; P$3 5,0; P$4 7.5,0; P$5 10,0; P$6 12.5,0; P$7 15,0; P$8 17.5,0; P$9 20,0; P$10 22.5,0; P$11 25,0; P$12 27.5,0; P$13 30,0; P$14 32.5,0; P$15 35,0; P$16 37.5,0
0428202214 = drill 2.8: P$1 0,0; P$2 0,5; P$3 -10,5; P$4 -10,0 | hole 3: 5.73,-9; -15.73,-9
LED_DIALIGHT_598 = smd 0.445 x 0.711: 1 -0.578,0; 2 0.578,0
SOT-23 = smd 0.813 x 0.889: 1 -1.025,-0.945; 2 1.025,-0.945; 3 0,0.945
C1 = smd 1.27 x 1.778: 1 -1.422,0; 2 1.422,0
1X05 = drill 1.016 pad 1.88: 1 0,0; 2 2.54,0; 3 5.08,0; 4 7.62,0; 5 10.16,0
BSS308PEH6327XTSA1 = smd 0.9 x 0.8: P$D -2,1; P$G 0,0; P$S 0,2
D2PAK = smd 1.041 x 3.505: 1 -2.54,-8.814; 3 2.54,-8.814 | smd 10.719 x 12.04: 2 0,0
TO-220 = drill 1.295 pad 1.803: 1 -5.08,0; 2 -2.54,0; 3 0,0
R0603 = smd 1 x 1.1: 1 -0.85,0; 2 0.85,0
R0805 = smd 1.3 x 1.5: 1 -0.95,0; 2 0.95,0
TL3305AF260QG = smd 1.6 x 1.4: P$1 -7.2,-3; P$2 0,-3; P$3 -7.2,0; P$4 0,0
TP5015 = smd 2.67 x 1.02: P$1 0,0
SSOP-48_G = smd 1.651 x 0.305: 1 -3.632,5.75; 2 -3.632,5.25; 3 -3.632,4.75; 4 -3.632,4.25; 5 -3.632,3.75; 6 -3.632,3.25; 7 -3.632,2.75; 8 -3.632,2.25; 9 -3.632,1.75; 10 -3.632,1.25; 11 -3.632,0.75; 12 -3.632,0.25; 13 -3.632,-0.25; 14 -3.632,-0.75; 15 -3.632,-1.25; 16 -3.632,-1.75; 17 -3.632,-2.25; 18 -3.632,-2.75; 19 -3.632,-3.25; 20 -3.632,-3.75; 21 -3.632,-4.25; 22 -3.632,-4.75; 23 -3.632,-5.25; 24 -3.632,-5.75; 25 3.632,-5.75; 26 3.632,-5.25; 27 3.632,-4.75; 28 3.632,-4.25; 29 3.632,-3.75; 30 3.632,-3.25; 31 3.632,-2.75; 32 3.632,-2.25; 33 3.632,-1.75; 34 3.632,-1.25; 35 3.632,-0.75; 36 3.632,-0.25; 37 3.632,0.25; 38 3.632,0.75; 39 3.632,1.25; 40 3.632,1.75; 41 3.632,2.25; 42 3.632,2.75; 43 3.632,3.25; 44 3.632,3.75; 45 3.632,4.25; 46 3.632,4.75; 47 3.632,5.25; 48 3.632,5.75
SIP3 = drill 1 long: 1 -2.54,0; 2 0,0; 3 2.54,0
TQFP44_MC = smd 1.473 x 0.508: 1 -5.619,4; 2 -5.619,3.2; 3 -5.619,2.4; 4 -5.619,1.6; 5 -5.619,0.8; 6 -5.619,0; 7 -5.619,-0.8; 8 -5.619,-1.6; 9 -5.619,-2.4; 10 -5.619,-3.2; 11 -5.619,-4; 23 5.619,-4; 24 5.619,-3.2; 25 5.619,-2.4; 26 5.619,-1.6; 27 5.619,-0.8; 28 5.619,0; 29 5.619,0.8; 30 5.619,1.6; 31 5.619,2.4; 32 5.619,3.2; 33 5.619,4 | smd 0.508 x 1.473: 12 -4,-5.619; 13 -3.2,-5.619; 14 -2.4,-5.619; 15 -1.6,-5.619; 16 -0.8,-5.619; 17 0,-5.619; 18 0.8,-5.619; 19 1.6,-5.619; 20 2.4,-5.619; 21 3.2,-5.619; 22 4,-5.619; 34 4,5.619; 35 3.2,5.619; 36 2.4,5.619; 37 1.6,5.619; 38 0.8,5.619; 39 0,5.619; 40 -0.8,5.619; 41 -1.6,5.619; 42 -2.4,5.619; 43 -3.2,5.619; 44 -4,5.619
SOIC-8 = smd 0.61 x 2.21: 1 -1.905,-2.616; 2 -0.635,-2.616; 3 0.635,-2.616; 4 1.905,-2.616; 5 1.905,2.616; 6 0.635,2.616; 7 -0.635,2.616; 8 -1.905,2.616
CRYSTAL_HC49SDLF = smd 5.499 x 2.108: 1 -4.794,0; 2 4.794,0

### Placement (x,y rotation side)
C1  19.32,35.05 180 top
C2  64.26,61.39 90 bottom
C3  39.39,63.75 90 top
C4  98.72,52.4 270 bottom
C5  16.02,41.53 90 top
C6  67.69,61.39 90 bottom
C7  71.24,61.39 90 bottom
C8  62.33,37.31 90 bottom
C9  84.5,43.64 90 top
C10  62.4,37.29 90 top
C11  94.08,47.22 270 top
C12  94.08,37.44 270 top
C13  97.71,63.42 0 bottom
C14  97.71,57.07 0 bottom
C16  97.71,69.77 0 bottom
C17  97.71,76.12 0 bottom
C18  97.71,82.47 0 bottom
C19  96.44,90.09 0 bottom
C20  85.11,85.09 270 bottom
C21  78.76,85.09 270 bottom
C22  72.41,85.09 270 bottom
C23  66.06,85.09 270 bottom
C24  59.71,85.09 270 bottom
C25  53.36,85.09 270 bottom
C26  15.26,81.28 90 top
CN1  105.53,96.67 180 top
CN2  27.96,22.86 0 top
CN3  111.07,30 90 top
CN4  57.17,22.86 0 top
D1  93.8,59.16 0 top
D2  93.8,65.51 0 top
D3  93.8,71.86 0 top
D4  93.8,78.21 0 top
D5  93.8,85.83 0 top
D6  93.92,92.18 0 top
D7  81.94,81.15 90 top
D8  75.46,81.15 90 top
D9  69.11,81.15 90 top
D10  62.89,81.15 90 top
D11  56.53,81.15 90 top
D12  50.19,81.15 90 top
D13  82.85,39.83 180 top
D14  84.25,53.16 270 top
D15  66.09,52.15 270 top
D16  76.45,53.26 90 top
D17  15.26,59.69 0 top
D18  54,47.62 180 top
F1  25.42,59.69 90 top
J1  59.1,52.27 270 top
J2  71.5,24.18 0 top
J3  101.16,23.14 0 top
Q1  52.09,87.63 0 top
Q2  100.27,57.25 270 top
Q3  100.27,63.6 270 top
Q4  100.27,69.95 270 top
Q5  100.27,76.3 270 top
Q6  100.27,82.65 270 top
Q7  100.27,90.27 270 top
Q8  83.84,87.63 0 top
Q9  77.49,87.63 0 top
Q10  71.14,87.63 0 top
Q11  64.79,87.63 0 top
Q12  58.44,87.63 0 top
Q13  99.89,34.44 90 bottom
Q14  30.5,92.71 0 top
Q15  46.88,46.74 90 top
Q16  41.93,92.71 0 top
Q17  31.9,44.32 270 top
R1  41.04,77.47 90 bottom
R2  53.36,88.9 90 bottom
R3  20.72,64.9 270 bottom
R4  28.59,77.72 90 bottom
R5  68.24,52.65 180 top
R6  72.84,52.73 0 top
R7  81.96,54.31 0 top
R8  78.73,52.12 180 top
R9  83.54,37.69 90 top
R10  96.57,25.1 270 top
R11  21.61,69.85 270 bottom
R12  24.15,69.85 270 bottom
R13  18.18,64.9 90 bottom
R14  26.05,77.72 270 bottom
R15  38.5,77.47 270 bottom
R16  107.51,27.2 0 bottom
R17  107.51,30.76 0 bottom
R18  107.51,34.32 0 bottom
R19  107.51,37.87 0 bottom
R20  107.51,41.43 0 bottom
R21  96.64,34.21 90 bottom
R22  92.65,34.19 270 bottom
R23  16.02,38.23 270 top
R24  59.71,88.9 90 bottom
R25  66.06,88.9 90 bottom
R26  72.41,88.9 90 bottom
R27  78.76,88.9 90 bottom
R28  85.11,88.9 90 bottom
R29  101.54,90.27 180 bottom
R30  101.7,82.45 180 bottom
R31  101.7,76.1 180 bottom
R32  101.7,69.75 180 bottom
R33  101.7,63.4 180 bottom
R34  101.7,57.05 180 bottom
R35  101.7,53.24 180 bottom
R36  54.5,76.33 90 top
R37  60.98,76.2 90 top
R38  67.33,76.2 90 top
R39  73.68,76.2 90 top
R40  80.03,76.2 90 top
R41  85.11,74.93 90 top
R42  89.02,86.44 90 top
R43  89.45,78.54 90 top
R44  89.45,72.31 90 top
R45  89.45,65.96 90 top
R46  89.45,59.61 90 top
R47  96.46,53.44 0 top
R48  52.6,81.28 0 top
R49  58.95,81.28 0 top
R50  65.3,81.28 0 top
R51  71.65,81.28 0 top
R52  78,81.28 0 top
R53  84.35,81.28 0 top
R54  93.92,89.76 270 top
R55  93.92,82.14 270 top
R56  93.92,75.79 270 top
R57  93.92,69.44 270 top
R58  93.92,63.09 270 top
R59  93.92,56.74 270 top
R60  104.34,43.15 0 top
R61  104.34,50.52 0 top
R62  96.46,57.25 270 top
R63  104.34,46.84 0 top
R64  101.01,38.91 90 top
R65  78.73,54.28 180 top
R66  81.96,52.15 0 top
R67  104.34,54.2 180 top
R68  54.63,44.45 90 top
R69  59.99,37.29 90 bottom
R70  104.31,39.34 0 top
R79  96.46,63.6 270 top
R82  96.46,69.95 270 top
R86  96.46,76.3 270 top
R90  96.46,82.65 270 top
R94  96.46,90.27 270 top
R98  83.84,83.82 0 top
R102  77.49,83.82 0 top
R106  71.14,83.82 0 top
R110  64.79,83.82 0 top
R118  58.44,83.82 0 top
R122  52.09,83.82 0 top
S2  86.41,22.94 180 top
TP1  107.97,10.16 90 top
TP3  74.82,10.16 90 top
TP4  72.41,10.16 90 top
TP5  105.35,10.19 90 top
TP6  77.41,10.19 90 top
TP7  80.03,10.16 90 top
TP8  82.57,10.16 90 top
TP9  87.65,10.16 90 top
TP10  85.11,10.16 90 top
TP11  90.19,10.16 90 top
TP12  102.89,10.16 90 top
TP13  100.35,10.16 90 top
TP14  97.81,10.16 90 top
TP15  95.27,10.16 90 top
TP16  92.73,10.16 90 top
U1  67.61,60.15 270 top
U3  51.68,63.17 270 top
U5  73.96,41.1 0 top
U7  22.88,39.37 90 top
Y1  89.2,43.64 90 top

### Tracks (layer width: path | path; a pad name or v marks a point on that pad's centre or on a via)
5V  (via drill 0.51)
  Top 0.254: R10.2 96.56,22.47 98.09,20.94 102.62,20.94 103.7,22.02 J3.2 | R23.2 20.18,37.38 U7.8 20.26,35.14 C1.1 20.17,32.93 v21.23,31.88 | D18.2 51.68,49.36 U3.3 | U5.7 65.96,40.3 64.05,38.39 64.05,37.24 63.25,36.44 C10.1 62.4,35.41 v63.52,34.29 | C9.1 84.47,42.76 84.47,42.16 83.41,41.1 U5.28 78.32,41.1 v77.38,40.16 | C3.1 35.2,59.55 33.6,57.95 v31.3,57.95 | R66.2 84,50.96 | 84,50.96 84.31,50.64 v85.21,50.64 | R65.2 76.89,54.28 D16.2 74.8,53.84 R6.2 v73.68,50.8 | U1.37 67.86,55.14 67.33,54.61 64.16,54.61 | 64.16,54.61 55.7,54.61 v55.29,55.02 | D15.2 65.29,51.57 64.16,52.7 64.16,54.61 | TP1.P$1 v107.97,6.35 | 84,50.96 84.25,51.21 D14.2
  Top 1.27: U3.3 50.6,59.55 C3.1
  Bottom 0.254: Q13.2 98.8,35.32 96.9,35.32 R21.2 95.27,36.44 v95.27,40.64 | C7.1 73.26,60.54 74.95,62.23 v74.95,63.5
  pour Route15: -31.73,113.03 156.23,113.03 156.23,-10.16 156.23,-11.43 12.72,-11.43 -31.73,-11.43
C_SENSE  (via drill 0.51)
  Top 0.254: U7.7 18.18,38.73 17.84,39.08 R23.1 | R23.1 C5.1 | v12.72,39.12 15.98,39.12 R23.1 | TP3.P$1 74.82,15.37 71.95,18.24 68.79,18.24 65.25,21.78 65.25,28.76 54.76,39.26 v54.76,41.15
  Bottom 0.254: R69.2 59.01,39.12 54.76,39.12 | 54.76,39.12 v12.72,39.12 | v54.76,41.15 54.76,39.12
CELL1  (via drill 0.51)
  Top 0.254: CN1.P$12 78.03,95.28 76.74,93.98 57.17,93.98 | 57.17,93.98 56.44,93.98 Q1.P$S 53.9,89.63 55.9,87.63 55.9,84.45 56.53,83.82 | D11.1 55.65,81.46 55.65,82.93 56.53,83.82 | 56.53,83.82 R118.1 | 57.17,93.98 v57.17,92.71
  Bottom 0.254: v57.17,92.71 54.21,89.75 R2.2
CELL2  (via drill 0.51)
  Top 0.254: CN1.P$11 80.53,95.37 78.63,93.47 64.79,93.47 | 64.79,93.47 62.28,93.47 Q12.P$S 60.25,89.63 62.25,87.63 62.25,84.33 62.76,83.82 | D10.1 62,81.46 62,83.06 62.76,83.82 | 62.76,83.82 R110.1 | 64.79,93.47 62.89,91.57 v62.63,91.57
  Bottom 0.254: v62.63,91.57 60.81,89.75 R24.2
CELL3  (via drill 0.51)
  Top 0.254: CN1.P$10 83.03,95.33 80.67,92.96 69.87,92.96 | 69.87,92.96 68.12,92.96 Q11.P$S 66.6,89.63 68.6,87.63 68.6,84.2 68.98,83.82 | D9.1 68.8,80.58 68.22,81.15 68.22,83.06 68.98,83.82 | R106.1 68.98,83.82 | 69.87,92.96 68.6,91.69 v68.6,91.44
  Bottom 0.254: v68.6,91.44 66.91,89.75 R25.2
CELL4  (via drill 0.51)
  Top 0.254: CN1.P$9 85.53,95.42 82.57,92.46 76.22,92.46 | 76.22,92.46 73.97,92.46 Q10.P$S 72.95,89.63 74.95,87.63 74.95,84.45 75.58,83.82 | D8.1 75.27,80.58 74.57,81.28 74.57,82.8 75.58,83.82 | R102.1 75.58,83.82 | 76.22,92.46 74.82,91.06 v74.7,91.06
  Bottom 0.254: v74.7,91.06 73.39,89.75 R26.2
CELL5  (via drill 0.51)
  Top 0.254: 81.3,91.95 84.6,91.95 88.03,95.38 CN1.P$8 | 81.3,91.95 79.81,91.95 Q9.P$S 79.3,89.63 81.3,87.63 81.3,84.45 81.94,83.82 | D7.1 81.05,81.46 81.05,82.93 81.94,83.82 | 81.94,83.82 R98.1 | 81.3,91.95 81.3,90.68 v81.17,90.55
  Bottom 0.254: v81.17,90.55 80.37,89.75 R27.2
CELL6  (via drill 0.51)
  Top 0.254: R94.1 96.46,92.02 95.14,93.34 93.87,93.34 93.35,92.82 D6.1 93.35,92.81 90.53,95.63 | Q8.P$S 84.57,89.63 86.38,91.44 | 90.53,95.63 90.53,95.59 86.38,91.44 | CN1.P$7 90.53,95.63 | v87.65,90.17 86.38,91.44
  Bottom 0.254: R28.2 87.23,89.75 v87.65,90.17
CELL7  (via drill 0.51)
  Top 0.254: D5.1 94.01,86.61 96.03,86.61 96.46,86.18 96.46,85.98 | 96.46,85.98 R90.1 | CN1.P$6 93.03,95.46 94.51,93.98 95.91,93.98 96.59,93.29 103.93,93.29 104.24,92.99 104.24,92.23 Q7.P$S 102.27,89.55 101.62,88.9 | 101.62,88.9 98.7,85.98 96.46,85.98 | v103.14,88.01 102.51,88.01 101.62,88.9
  Bottom 0.254: R29.2 103.14,89.52 v103.14,88.01
CELL8  (via drill 0.51)
  Top 0.254: CN1.P$5 95.53,95.52 97.25,93.8 104.29,93.8 104.74,93.34 104.74,86.39 102.27,83.92 Q6.P$S 102.27,81.93 100.99,80.64 | D4.1 94.01,78.99 95.65,78.99 96.46,78.18 | 96.46,78.18 R86.1 | 96.46,78.18 96.51,78.23 98.57,78.23 100.99,80.64 | v103.65,80.14 101.49,80.14 100.99,80.64
  Bottom 0.254: R30.2 103.65,81.34 v103.65,80.14
CELL9  (via drill 0.51)
  Top 0.254: CN1.P$4 98.03,95.49 99.21,94.31 104.6,94.31 105.25,93.66 105.25,79.28 Q5.P$S 102.27,75.58 101.62,74.93 | D3.1 94.01,72.64 95.78,72.64 96.46,71.96 | 96.46,71.96 R82.1 | 96.46,71.96 96.51,72.01 98.7,72.01 101.62,74.93 | v104.16,73.66 102.89,73.66 101.62,74.93
  Bottom 0.254: R31.2 104.16,74.48 v104.16,73.66
CELL10  (via drill 0.51)
  Top 0.254: 103.8,71.48 105.76,73.44 105.76,93.87 104.81,94.82 101.24,94.82 100.53,95.53 CN1.P$3 | 103.8,71.48 Q4.P$S 102.27,69.23 98.95,65.91 96.46,65.91 96.46,65.86 | D2.1 94.01,66.29 96.03,66.29 96.46,65.86 | 96.46,65.86 R79.1 | v104.67,69.22 104.67,70.61 103.8,71.48
  Bottom 0.254: v104.67,69.22 104.13,69.75 R32.2
CELL11  (via drill 0.51)
  Top 0.254: 104.44,65.76 106.27,67.6 106.27,94.08 105.02,95.33 103.37,95.33 103.04,95.66 103.04,96.66 CN1.P$2 | 104.44,65.76 Q3.P$S 102.27,62.88 98.83,59.44 96.29,59.44 | D1.1 94.01,59.94 95.78,59.94 96.29,59.44 | R62.1 96.46,59.26 96.29,59.44 | v105.05,62.48 105.05,65.15 104.44,65.76
  Bottom 0.254: R33.2 104.13,63.4 v105.05,62.48
CELL12  (via drill 0.51)
  Top 0.254: 104.44,59.41 106.78,61.75 106.78,94.41 105.53,95.66 CN1.P$1 | 104.44,59.41 Q2.P$S | v105.43,57.15 105.43,58.42 104.44,59.41
  Bottom 0.254: R34.2 102.65,57.15 v105.43,57.15 105.43,56.12 R35.2
CLK  (via drill 0.51)
  Top 0.254: R6.1 | R6.1 71.36,52.72 70.36,53.72 U1.42 70.38,56.53 70.38,59.57 72.09,61.29 75.66,61.29 77.49,63.12 v80.03,63.12 | U5.41 72.36,44.65 v72.28,44.58 | v71.52,50.55 71.98,51.01 R6.1 | TP11.P$1 v90.19,6.35
  Bottom 0.254: v72.28,44.58 72.28,49.78 v71.52,50.55 | v90.19,6.35 90.19,22.88 82.95,30.12 74.06,30.12 68.24,35.94 68.24,38.99 70.25,41 78.38,41 84.37,46.99 84.37,50.29 80.03,54.63 v80.03,63.12
CS_1  (via drill 0.51)
  Top 0.254: U1.41 69.87,56.5 69.87,54.61 69.09,53.83 R5.1 69.11,52.64 v69.11,50.29 | U5.37 75.56,45.31 v74.82,44.58
  Bottom 0.254: v74.82,44.58 73.43,43.18 71.14,43.18 69.11,45.21 v69.11,50.29
GND  (via drill 0.51)
  Top 0.254: D12.1 50.13,80.58 49.42,81.28 | 49.42,81.28 49.3,81.41 49.3,82.8 50.31,83.82 R122.1 | U7.6 U7.5 20.26,41.73 19.62,42.38 19.07,42.38 | 19.07,42.38 C5.2 11.92,42.38 11.07,41.53 11.07,36.07 12.09,35.05 C1.2 18.47,28.37 CN2.P$3 | R68.1 56.12,42.11 J1.5 59.1,41.44 C10.2 63.05,38.14 66.01,41.1 U5.6 73.76,41.1 74.56,41.9 U5.29 82.3,41.9 83.08,42.67 83.08,43.69 83.88,44.49 C9.2 85.71,44.49 86.51,43.69 86.51,37.97 85.38,36.84 R9.1 | C11.2 94,46.29 v94,44.45 | C12.2 92.08,36.59 v91.97,36.7 | R70.1 103.46,37.4 v101.62,35.56 | U1.45 U1.46 U1.47 U1.48 75.26,58.42 80.03,58.42 v81.3,59.69 | C3.2 34.44,67.96 32.52,66.04 v30.5,66.04 | Q14.2 v30.5,82.55 | v41.93,82.55 Q16.2 | TP5.P$1 105.43,10.11 v105.43,6.35 | S2.P$3 92.65,22.94 v91.46,24.13 90.27,22.94 S2.P$4 | 19.07,55.88 v19.07,48.26 19.07,42.38 | 49.42,81.28 v47.01,81.28 | U1.31 U1.30 64.36,55.45 63.98,55.07 62.86,55.07 62.36,55.57 U1.26 62.36,58.95 61.93,59.37 | 61.93,59.37 v60.98,60.33 | U1.40 69.36,60.2 68.6,60.96 63.52,60.96 61.93,59.37
  Top 0.508: D17.1 14.23,56.91 15.26,55.88 19.07,55.88 | C26.2 v15.26,92.71
  Top 1.27: C3.2 43.44,67.96 48.23,63.17 U3.2
  Bottom 0.254: R1.1 42.35,76.62 43.2,77.47 43.2,81.28 v41.93,82.55 | R4.1 29.9,76.87 30.5,77.47 v30.5,82.55 | C4.2 96.02,51.55 v95.27,50.8 | C25.2 48.7,84.24 47.39,82.93 v47.26,82.93 | C7.2 C6.2 C2.2 64.26,64.03 v58.44,69.85 | C8.2 59.1,41.39 J1.5
  pour Route2: -17.76,106.68 133.37,106.68 133.37,19.05 133.37,-10.16 -15.22,-10.16 -17.76,-10.16
  pour Top (rank 2): -27.92,115.57 -27.92,-17.78 -16.49,-17.78 149.88,-17.78 149.88,-15.24 149.88,110.49 149.88,115.57
  pour Bottom: -10.14,106.68 -10.14,-10.16 119.4,-10.16 134.64,-10.16 134.64,102.87 134.64,106.68
GPIO_1
  Top 0.254: CN3.P$8 109.75,47.5 106.45,44.2 106.45,41.91 | R64.2 101.12,39.76 103.27,41.91 106.45,41.91 | R70.2 106.45,39.34 106.45,41.91
GPIO_2
  Top 0.254: CN3.P$9 110.34,50 105.19,44.84 R60.2
GPIO_3
  Top 0.254: R63.2 105.19,48.02 109.67,52.5 CN3.P$10
GPIO_4
  Top 0.254: CN3.P$11 108.61,55 105.19,51.57 R61.2
GPIO_5
  Top 0.254: CN3.P$12 109.33,57.5 106.04,54.2 R67.1
I2C_CLK  (via drill 0.51)
  Top 0.254: U5.16 73.16,33.29 73.5,32.94 73.5,32.93 74.48,31.95 81.55,31.95 82.41,32.82 102.06,32.82 107.36,38.11 107.36,41.3 108.56,42.5 CN3.P$6 112.21,42.5 113.18,41.53 113.18,27.18 111.68,25.68 111.4,25.68 | J3.5 111.4,23.14 111.4,25.68 | J2.5 81.66,25.76 83.84,27.94 110.64,27.94 111.4,27.18 111.4,25.68 | TP8.P$1 v82.57,6.35
  Bottom 0.254: v82.57,6.35 82.57,20.95 81.66,21.87 J2.5
I2C_DATA  (via drill 0.51)
  Top 0.254: U5.17 73.96,33.12 74.67,32.41 81.36,32.41 82.22,33.27 101.87,33.27 106.9,38.3 106.9,43.38 108.52,45 CN3.P$7 112.5,45 113.69,43.81 113.69,20.95 113.05,20.32 109.6,20.32 108.78,21.13 | J2.4 79.12,23.14 81.94,20.32 107.97,20.32 108.78,21.13 | TP7.P$1 v80.03,6.35 | 108.78,21.13 J3.4
  Bottom 0.254: v80.03,6.35 80.03,20.95 79.12,21.87 J2.4
MISO  (via drill 0.51)
  Top 0.254: U5.42 71.56,48.16 72.47,49.07 79.57,49.07 81.11,50.61 R66.1 R7.1 81.11,55.56 80.16,56.52 75.58,56.52 73.93,54.86 71.78,54.86 71.36,55.28 U1.44 71.36,58.38 72.41,59.44 v75.97,59.44 | TP10.P$1 v85.11,6.35
  Bottom 0.254: v85.11,6.35 85.11,26.67 82.57,29.21 73.68,29.21 67.33,35.56 67.33,39.37 69.87,41.91 78,41.91 83.46,47.37 83.46,49.91 75.97,57.4 v75.97,59.44
MOSI  (via drill 0.51)
  Top 0.254: U1.43 70.88,56.5 | 70.88,56.5 70.88,55.12 71.59,54.41 74.12,54.41 75.77,56.06 79.14,56.06 79.58,55.61 R65.1 R8.1 76.99,49.53 72.28,49.53 70.85,48.1 70.85,46.8 U5.43 | TP9.P$1 v87.65,6.35 | v78.25,60.83 72.28,60.83 70.88,59.43 70.88,56.5
  Bottom 0.254: v87.65,6.35 87.65,24.78 82.76,29.67 73.87,29.67 67.79,35.75 67.79,39.18 70.06,41.45 78.19,41.45 83.92,47.18 83.92,50.1 78.25,55.77 v78.25,60.83
N$1
  Top 0.254: D16.1 77.01,52.12 R8.2
N$2
  Top 0.254: R7.2 83.38,53.74 D14.1
N$3
  Top 0.254: R5.2 67.33,52.72 D15.1
N$4
  Bottom 0.508: R13.2 R3.1 21.9,65.75 22.88,64.77 22.88,55.88 29.36,49.4 Q17.1
N$5
  Top 0.254: R61.1 101.72,50.52 97,45.8 97,36.64 95.46,35.1 78.33,35.1 U5.22
N$6
  Top 0.254: R63.1 98.93,46.84 97.45,45.36 97.45,36.45 95.65,34.65 81.66,34.65 80.79,33.78 77.74,33.78 77.16,34.37 U5.21
N$7
  Top 0.254: U5.20 76.36,34.3 76.35,34.29 77.31,33.33 80.98,33.33 81.84,34.19 95.84,34.19 97.91,36.26 97.91,40.11 97.94,40.13 97.91,40.16 97.91,41.53 99.54,43.16 R60.1
N$8
  Top 0.254: R64.1 100.36,38.06 96.03,33.73 82.03,33.73 81.17,32.87 77.12,32.87 75.89,34.1 75.89,34.11 75.56,34.44 U5.19
N$9
  Top 0.254: R68.2 54.63,47.57 D18.1
N$10
  Top 0.254: R67.2 96.54,47.26 96.54,36.83 95.27,35.56 85.11,35.56 85.1,35.57 80.21,35.57 79.58,36.21 U5.23
N$11  (via drill 0.51)
  Top 0.254: U5.39 73.96,48.16 74.31,48.51 80.67,48.51 v81.55,47.62
  Bottom 0.254: v81.55,47.62 76.6,42.67 69.49,42.67 63.25,36.44 R69.1 60.02,36.46 C8.1
N$37
  Top 0.508: D17.3 15.26,62.38 | F1.2 24.15,62.38 15.26,62.38 | C26.1 11.45,72.87 11.45,63.5 12.57,62.38 15.26,62.38
  Top 0.762: U3.1 51.68,67.21 47.62,71.27 29.36,71.27 25.42,67.33 F1.2
N$38  (via drill 0.51)
  Top 0.254: U1.35 66.86,57.95 67.33,58.42 v67.71,58.42
  Bottom 0.254: v67.71,58.42 67.71,60.52 C6.1
N$39  (via drill 0.51)
  Top 0.508: Q14.3 33.04,77.47 30.37,74.8 v24.15,74.8
  Bottom 0.508: v24.15,74.8 R12.1
N$40  (via drill 0.51)
  Top 0.254: U1.34 66.36,57.49 65.93,57.91 65.17,57.91 v64.41,58.67
  Bottom 0.254: v64.41,58.67 64.26,58.83 C2.1
N$41
  Top 0.254: U5.31 80.35,43.5 85.28,48.43 Y1.2 93.71,48.43 C11.1
N$42
  Bottom 0.254: R22.2 96.62,33.34 R21.1 98.89,33.36 Q13.1
N$43
  Top 0.254: C12.1 89.75,38.29 Y1.1 89.2,39.62 89.2,40.62 89.2,43.79 88.67,44.32 88.41,44.32 86,46.74 84.28,46.74 80.45,42.91 79.79,42.91 U5.30
N$44
  Bottom 0.508: R11.1 22.45,70.7 R12.2 36.85,56.3 36.85,44.45 39.64,41.66 Q15.1
N$46  (via drill 0.51)
  Top 0.508: v28.72,80.52 27.96,81.28 Q14.1
  Bottom 0.508: v28.72,80.52 28.72,78.7 R4.2 R14.1
N$47  (via drill 0.51)
  Top 0.508: Q16.3 44.47,76.2 40.53,72.26 19.45,72.26 13.99,66.8 v13.99,64.77
  Bottom 0.508: v13.99,64.77 14.71,64.05 R13.1
N$48  (via drill 0.51)
  Top 0.508: Q16.1 39.39,81.79 v41.04,80.14
  Bottom 0.508: v41.04,80.14 R1.2 R15.1
N$49  (via drill 0.51)
  Top 0.254: U5.18 74.76,37.91 v74.95,38.1 | J3.1 98.36,25.95 R10.1 96.56,25.94 S2.P$1 S2.P$2
  Bottom 0.254: v74.95,38.1 81.3,31.75 95.27,31.75 101.16,25.86 J3.1
N$50
  Top 0.254: U5.24 80.84,37.9 81.3,38.35 81.3,39.37 81.76,39.83 D13.2
N$51
  Top 0.254: D13.1 83.43,38.65 R9.2
N$52  (via drill 0.51)
  Top 0.254: TP6.P$1 77.41,12.62 83.84,19.05 v97.81,19.05
  Bottom 0.254: 106.66,34.29 R17.2 R16.2 106.66,26.33 107.21,25.78 114.57,25.78 115.08,25.27 115.08,24.32 109.82,19.05 v97.81,19.05 | 106.66,34.29 R18.2 R19.2 R20.2 | Q13.3 106.51,34.44 106.66,34.29
N$56
  Top 0.254: R47.2 99.18,53.44 100.27,54.53 Q2.P$G
N$57
  Top 0.254: R47.1 88.82,53.44 86.38,55.88 86.38,63.45 84.38,65.46 84.36,65.46 83.52,66.29 72.6,66.29 72.6,66.23 72.38,66.01 72.38,63.8 U1.3
N$58  (via drill 0.51)
  Top 0.254: v84.98,60.83 84.98,64.18 83.33,65.84 73.68,65.84 72.86,65.02 U1.2
  Bottom 0.254: R34.1 100.82,57.07 C14.1 98.56,55.36 97.81,54.61 87.65,54.61 84.98,57.28 v84.98,60.83
N$59
  Top 0.254: Q2.P$D 99.91,59.25 99.08,58.42 99.08,57.15 98.23,56.3 R62.2 96.06,55.89 R59.2
N$60
  Top 0.254: R59.1 94.38,58.04 D1.2
N$61  (via drill 0.51)
  Top 0.254: U1.4 71.86,66.2 72.41,66.75 83.71,66.75 84.54,65.91 84.57,65.91 87.19,63.29 87.19,57.73 v88.41,56.52
  Bottom 0.254: v88.41,56.52 93.87,61.98 98,61.98 98.56,62.53 C13.1 100.82,63.42 | 100.82,63.42 R33.1 | C14.2 96.86,60.01 97.81,60.96 100.35,60.96 100.82,61.43 100.82,63.42
N$62
  Top 0.254: U1.5 71.36,66.88 71.69,67.21 83.89,67.21 84.73,66.37 84.76,66.37 87.65,63.48 87.65,59.31 88.19,58.76 R46.1
N$63
  Top 0.254: Q3.P$G 100.27,62.15 99.08,60.96 94,60.96 93.5,60.46 R46.2
N$64
  Top 0.254: Q3.P$D 99.91,65.6 99.08,64.77 99.08,63.5 98.23,62.65 R79.2 96.06,62.24 R58.2
N$65
  Top 0.254: R58.1 94.38,64.39 D2.2
N$66  (via drill 0.51)
  Top 0.254: U1.6 70.86,67.03 71.5,67.67 84.08,67.67 84.92,66.83 84.95,66.83 88.65,63.12 v89.68,63.12
  Bottom 0.254: R32.1 100.82,69.77 C16.1 98.56,68.06 96.86,66.36 C13.2 96.55,63.12 v89.68,63.12
N$67
  Top 0.254: Q4.P$G 100.35,69.88 100.35,68.58 99.08,67.31 94,67.31 93.5,66.81 R45.2
N$68
  Top 0.254: U1.7 70.36,67.53 70.95,68.12 84.27,68.12 85.11,67.28 85.14,67.28 87.31,65.11 R45.1
N$69
  Top 0.254: Q4.P$D 99.91,71.95 99.08,71.12 99.08,69.85 98.23,69 R82.2 96.06,68.59 R57.2
N$70
  Top 0.254: R57.1 94.38,70.74 D3.2
N$71
  Top 0.254: Q5.P$G 100.27,74.85 99.08,73.66 94,73.66 93.5,73.16 R44.2
N$72  (via drill 0.51)
  Top 0.254: U1.8 69.87,67.82 70.63,68.58 84.46,68.58 85.3,67.74 87.84,67.74 88.81,68.71 v90.19,68.71
  Bottom 0.254: R31.1 100.82,76.12 C17.1 98.57,76.11 98.57,75.18 98.06,74.68 96.16,74.68 94.57,73.09 | v90.19,68.71 94.57,73.09 | C16.2 96.86,70.93 94.7,73.09 94.57,73.09
N$73
  Top 0.254: U1.9 69.36,68.07 70.38,69.09 84.6,69.09 85.49,68.2 87.65,68.2 89.45,70 R44.1
N$74
  Top 0.254: Q5.P$D 99.91,78.3 99.08,77.47 99.08,76.2 98.23,75.35 R86.2 96.06,74.94 R56.2
N$75
  Top 0.254: R56.1 94.38,77.09 D4.2
N$76  (via drill 0.51)
  Top 0.254: U1.10 68.86,68.84 69.56,69.55 86.84,69.55 v86.89,69.6
  Bottom 0.254: v86.89,69.6 96.29,78.99 | 96.29,78.99 98.56,81.27 C18.1 100.82,82.47 R30.1 | C17.2 96.86,78.42 96.29,78.99
N$77
  Top 0.254: Q6.P$G 100.27,81.2 99.08,80.01 94,80.01 93.38,79.39 R43.2
N$78
  Top 0.254: U1.11 68.36,69.25 69.11,70 85.04,70 88.21,73.17 88.21,74.93 89.45,76.17 R43.1
N$79
  Top 0.254: R55.2 96.06,81.29 R90.2 98.23,81.7 99.08,82.55 99.08,83.82 99.91,84.65 Q6.P$D
N$80
  Top 0.254: R55.1 93.92,84.26 94.38,84.71 D5.2
N$81  (via drill 0.51)
  Top 0.254: U1.12 67.86,69.62 68.7,70.46 84.85,70.46 87.75,73.36 87.75,81 v90.32,83.57
  Bottom 0.254: v90.32,83.57 92.98,83.57 94.08,82.47 C18.2 96.86,87.71 98.25,89.1 | R29.1 99.42,90.27 98.25,89.1 | C19.1 98.25,89.13 98.25,89.1
N$82
  Top 0.254: Q7.P$G 100.27,88.82 99.08,87.63 94,87.63 93.66,87.29 R42.2
N$83
  Top 0.254: R54.2 96.06,88.91 R94.2 98.23,89.32 99.08,90.17 99.08,91.44 99.91,92.27 Q7.P$D
N$84
  Top 0.254: R54.1 94.5,91.19 D6.2
N$85
  Top 0.254: Q8.P$G 85.11,86.36 86.38,85.09 86.38,80.01 85.11,78.74 R41.2
N$86
  Top 0.254: Q8.P$D 81.84,87.09 82.57,86.36 83.84,86.36 84.79,85.41 R98.2 85.2,83.41 R53.2
N$87
  Top 0.254: R53.1 83.05,81.73 D7.2
N$88
  Top 0.254: Q9.P$G 78.76,87.63 80.03,86.36 R40.2
N$89
  Top 0.254: Q9.P$D 75.49,87.09 76.22,86.36 77.49,86.36 78.44,85.41 R102.2 78.85,83.41 R52.2
N$90
  Top 0.254: R52.1 76.7,81.73 D8.2
N$91
  Top 0.254: Q10.P$G 72.41,87.63 73.68,86.36 R39.2
N$92
  Top 0.254: Q10.P$D 69.14,87.09 69.87,86.36 71.14,86.36 72.09,85.41 R106.2 72.5,83.41 R51.2
N$93
  Top 0.254: R51.1 70.35,81.73 D9.2
N$94
  Top 0.254: Q11.P$G 66.06,87.63 67.33,86.36 R38.2
N$95
  Top 0.254: Q11.P$D 62.79,87.09 63.52,86.36 64.79,86.36 65.74,85.41 R110.2 66.15,83.41 R50.2
N$96
  Top 0.254: R50.1 64,81.73 D10.2
N$97  (via drill 0.51)
  Top 0.254: U1.22 62.86,76.17 v63.27,76.58
  Bottom 0.254: R24.1 C24.1 61.4,85.94 63.1,84.24 C23.2 66.06,82.97 63.27,80.18 v63.27,76.58
N$98
  Top 0.254: U1.21 63.36,74.52 64.19,75.35 R38.1
N$99  (via drill 0.51)
  Top 0.254: U1.20 63.86,71.71 66.57,74.42 68.98,74.42 69.62,75.06 v69.62,76.58
  Bottom 0.254: v69.62,76.58 69.62,79.76 72.41,82.55 C22.2 69.45,84.24 67.75,85.94 C23.1 R25.1
N$100
  Top 0.254: U1.19 64.36,71.45 66.57,73.66 69.87,73.66 71.56,75.35 R39.1
N$101  (via drill 0.51)
  Top 0.254: U1.18 64.86,71.18 66.88,73.2 74.49,73.2 76.22,74.93 v76.22,76.2
  Bottom 0.254: v76.22,76.2 76.22,80.01 78.76,82.55 C21.2 75.8,84.24 74.1,85.94 C22.1 R26.1
N$102
  Top 0.254: U1.17 65.36,70.9 67.2,72.75 79.12,72.75 80.03,73.66 R40.1
N$103  (via drill 0.51)
  Top 0.254: U1.16 65.86,70.63 67.52,72.29 80.18,72.29 82.19,74.3 v82.19,76.33
  Bottom 0.254: R27.1 C21.1 80.45,85.94 82.15,84.24 C20.2 85.11,79.25 v82.19,76.33
N$104
  Top 0.254: U1.15 66.36,70.36 67.83,71.83 80.37,71.83 82.62,74.08 R41.1
N$105  (via drill 0.51)
  Top 0.254: v90.19,90.17 88.79,88.77 86.63,88.77 85.75,87.88 85.75,86.37 86.84,85.28 86.84,73.74 84.47,71.37 68.09,71.37 66.86,70.14 U1.14
  Bottom 0.254: C20.1 R28.1 84.69,88.05 83.84,88.9 83.84,91.44 85.11,92.71 87.65,92.71 v90.19,90.17 95.51,90.17 C19.2
N$106
  Top 0.254: U1.13 67.36,69.87 68.41,70.92 84.66,70.92 87.29,73.55 87.29,82.19 89.02,83.92 R42.1
N$110
  Top 0.254: Q12.P$G 59.71,87.63 60.98,86.36 R37.2
N$111
  Top 0.254: Q12.P$D 56.44,87.09 57.17,86.36 58.44,86.36 59.39,85.41 R118.2 59.8,83.41 R49.2
N$112
  Top 0.254: R49.1 57.65,81.73 D11.2
N$113
  Top 0.254: U1.23 62.36,75.08 62.08,75.35 R37.1
N$114  (via drill 0.51)
  Top 0.254: U1.24 61.86,71.51 v57.17,76.2
  Bottom 0.254: R2.1 C25.1 56.32,85.94 58.02,84.24 C24.2 59.71,82.97 57.17,80.43 v57.17,76.2
N$115
  Top 0.254: Q1.P$G 53.36,87.63 54.63,86.36 54.63,77.3 R36.2
N$116
  Top 0.254: Q1.P$D 50.09,87.09 50.82,86.36 52.09,86.36 53.04,85.41 R122.2 53.45,83.41 R48.2
N$117
  Top 0.254: R48.1 51.3,81.73 D12.2
N$118
  Top 0.254: U1.25 59.71,58.66 59.71,71.12 55.35,75.48 R36.1
RX
  Top 0.254: J1.3 64.59,47.19 66.68,45.1 U5.1
TEMP1  (via drill 0.51)
  Top 0.254: CN3.P$1 102.36,30 101.82,30.53 83.36,30.53 82.5,29.67 69.76,29.67 64.51,34.92 64.51,38.08 65.93,39.5 U5.8 | TP16.P$1 v92.73,6.35
  Bottom 0.254: R16.1 108.36,28.33 110.03,30 CN3.P$1 114.37,30 116.3,28.07 116.3,22.35 105.38,11.43 97.81,11.43 v92.73,6.35
TEMP2  (via drill 0.51)
  Top 0.254: CN3.P$2 104.33,32.5 102.82,30.99 83.17,30.99 82.31,30.12 69.95,30.12 64.97,35.1 64.97,37.64 66.02,38.7 U5.9 | TP15.P$1 v95.27,6.35
  Bottom 0.254: R17.1 110.1,32.5 CN3.P$2 114.74,32.5 116.76,30.48 116.76,22.16 105.55,10.95 99.87,10.95 v95.27,6.35
TEMP3  (via drill 0.51)
  Top 0.254: CN3.P$3 106.18,35 102.63,31.45 82.98,31.45 82.12,30.58 70.14,30.58 65.42,35.29 65.42,36.83 66.49,37.9 U5.10 | TP14.P$1 v97.81,6.35
  Bottom 0.254: R18.1 109.04,35 CN3.P$3 114.98,35 117.22,32.77 117.22,21.97 105.74,10.49 101.95,10.49 v97.81,6.35
TEMP4  (via drill 0.51)
  Top 0.254: CN3.P$4 108.04,37.5 102.44,31.9 82.79,31.9 81.93,31.04 70.58,31.04 68.34,33.28 U5.11 | TP13.P$1 v100.35,6.35
  Bottom 0.254: R19.1 108.74,37.5 CN3.P$4 115.74,37.5 117.67,35.56 117.67,21.78 105.93,10.03 104.03,10.03 v100.35,6.35
TEMP5  (via drill 0.51)
  Top 0.254: CN3.P$5 108.6,40 107.82,39.22 107.82,37.92 102.25,32.36 82.6,32.36 81.74,31.5 72.79,31.5 71.65,32.64 71.65,35.39 U5.14 | TP12.P$1 v102.89,6.35
  Bottom 0.254: R20.1 109.79,40 CN3.P$5 116.23,40 118.13,38.1 118.13,21.59 v102.89,6.35
TEMP_FET  (via drill 0.51)
  Top 0.254: U5.15 72.41,35.53 v72.41,38.1
  Bottom 0.254: v72.41,38.1 73.93,39.62 76.73,39.62 81.31,35.04 R22.1
TO_CHARGER/MOTOR
  Bottom 0.508: Q17.3 27.96,44.32 20.72,51.56 R3.2
  pour Top: 29.99,45.21 49.68,45.21 49.68,42.93 45.11,42.93 45.11,38.61 53.61,38.61 53.61,16.64 38.37,16.64 38.37,40.39 29.99,40.39
TO_CHARGER_EN  (via drill 0.51)
  Top 0.254: U5.2 68.19,44.45 v64.79,44.45
  Bottom 0.254: v64.79,44.45 62.71,46.53 62.71,53.53 58.9,57.34 58.9,66.23 51.01,74.12 39.64,74.12 38.5,75.26 R15.2
TO_MOTOR_EN  (via drill 0.51)
  Top 0.254: v63.52,40.64 66.38,43.5 U5.3
  Bottom 0.254: R14.2 26.05,75.35 27.74,73.66 50.82,73.66 58.44,66.04 58.44,57.15 62.25,53.34 62.25,41.91 v63.52,40.64
TX
  Top 0.254: J1.2 62.05,49.73 62.76,49.02 68.85,49.02 70,47.88 69.96,47.84 U5.44
V+  (via drill 0.51)
  Top 0.254: v82.95,63.5 81.07,65.38 73.87,65.38 73.36,64.87 U1.1
  Bottom 0.254: R35.1 100.83,53.25 C4.1 87.74,53.25 82.95,58.04 v82.95,63.5
VCC
  pour Top: 22.37,39.24 36.98,39.24 36.98,16.64 22.37,16.64
VCC_1  (via drill 0.51)
  Top 0.254: U7.4 25.5,58.27 F1.1 | Q15.3 47.14,46.99 50.82,46.99 52.09,45.72 52.09,41.27 64.79,28.57 64.79,21.59 68.6,17.78 71.14,17.78 72.41,16.51 TP4.P$1
  Top 0.508: v29.23,58.42 29.08,58.27 F1.1
  Bottom 0.508: R11.2 29.23,61.38 v29.23,58.42
  pour Top: 34.31,45.72 49.68,45.72 49.68,51.44 34.31,51.44
  pour Top: 22.37,39.75 22.37,55.88 29.48,55.88 30.25,55.88 30.25,48.26 30.25,48.01 35.07,48.01 36.72,48.01 36.72,45.72 29.36,45.72 29.36,39.88 29.36,39.75

### Text on the board
tPlace: (-) | Q7 | (+) | Q1 | Q12 | Q11 | Q10 | Q9 | Q8 | Q6 | Q5 | Q4 | Q3 | /Users/TylerMatthews/Downloads/1200px-University_of_Akron_seal.bmp | LTC6804 | GND | Q2 | 5V | MOSI | MISO | 5 | 4 | 3 | (1) | FTDI | 2 | GPIO | 1 | D | C | I2C | TYLER MATTHEWS / CYCLE ASSIST / 12S BMS | 5 | 4 | 3 | GND | VCC | VCC | GND | 2 | TEMPS | 1 | RESET | CN2 | CN1 | (CLK) | (1) | SCREEN | PROG | VCC | C_SEN | TEMP_5V | I2C_DAT | I2C_CLK | MISO | MOSI | SPI_CLK | TEMP1 | TEMP2 | TEMP3 | TEMP4 | TEMP5 | GND | 5V